# Altium project MML_Control_board.PrjPcb
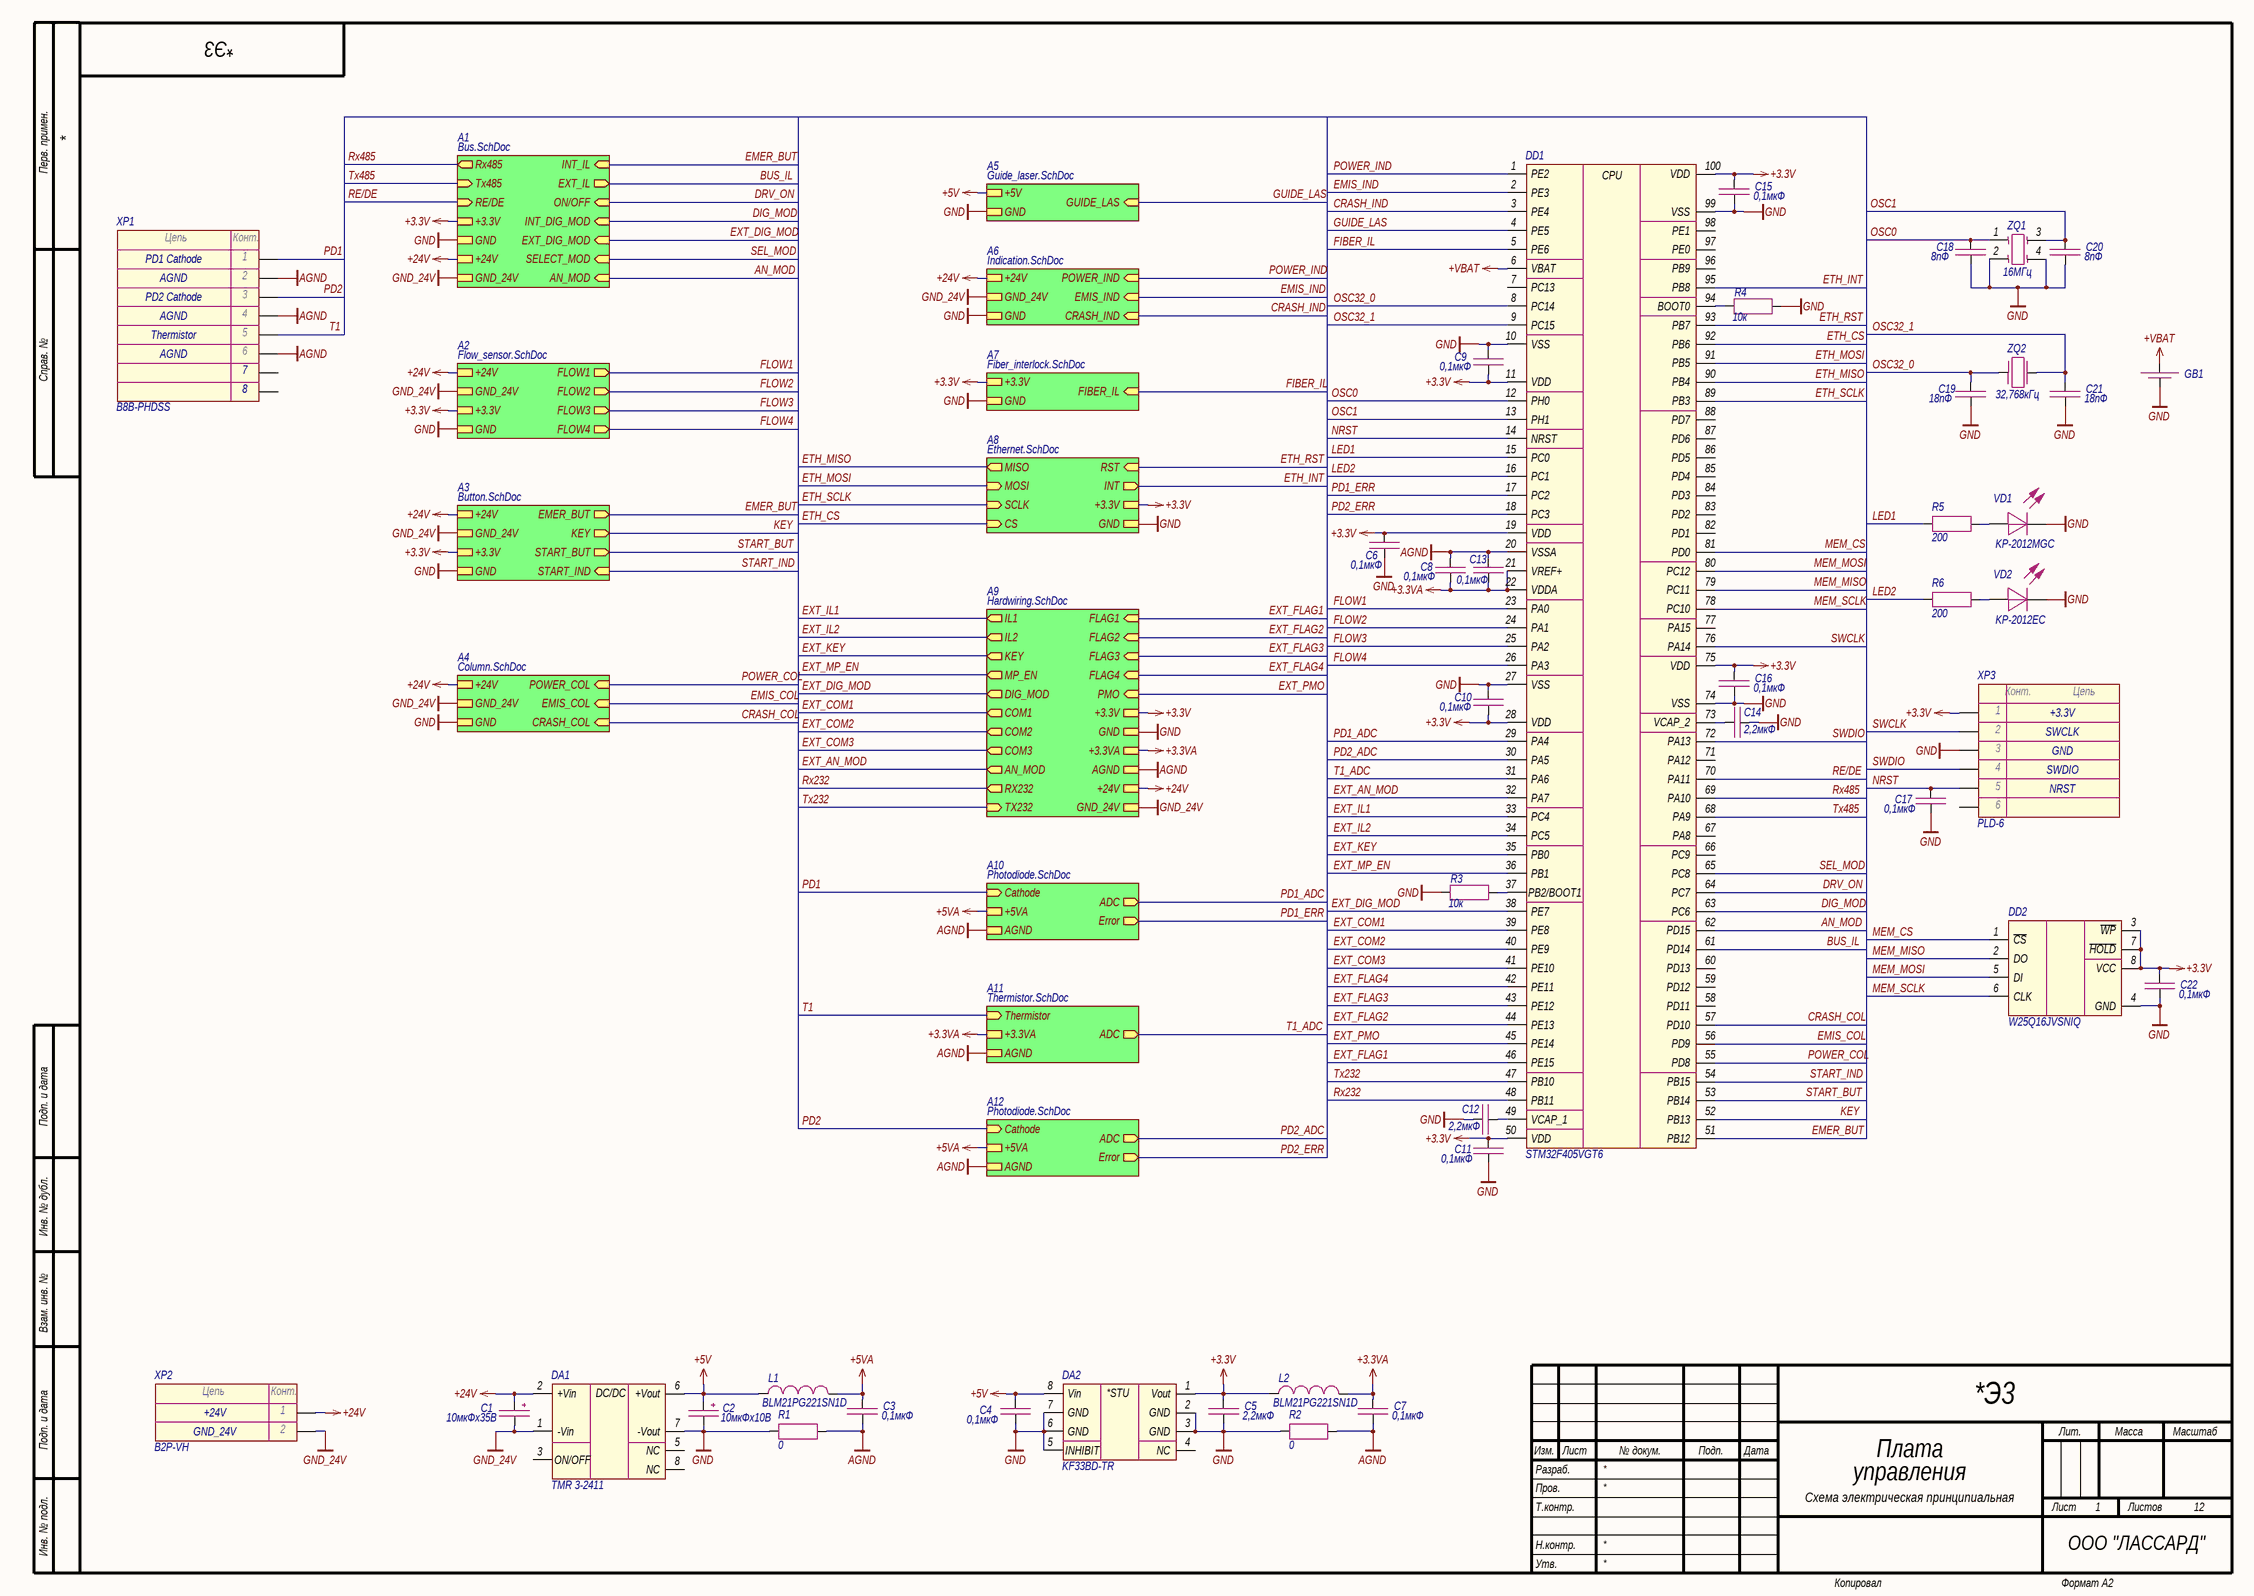
[diagram p0: Main.SchDoc]
12 sheets, 286 parts. Net scope: strictly hierarchical (ports join the sheet entries above them; power ports are local).
Board file: PCB1.PcbDoc
Sheets:
  Main.SchDoc
    A6 = Indication.SchDoc
    A9 = Hardwiring.SchDoc
    A8 = Ethernet.SchDoc
    A5 = Guide_laser.SchDoc
    A7 = Fiber_interlock.SchDoc
    A1 = Bus.SchDoc
    A2 = Flow_sensor.SchDoc
    A3 = Button.SchDoc
    A4 = Column.SchDoc
    A11 = Thermistor.SchDoc
    A10 = Photodiode.SchDoc
    A12 = Photodiode.SchDoc

## Sheet Main.SchDoc: Плата
size 594 x 420 mm; CompanyName: ООО "ЛАССАРД"; Address1: Address1; Address2: Address2; Address3: Address3; Address4: Address4; DocumentNumber: *Э3; SheetNumber: 1; SheetTotal: 12; Title2str: управления; DocumentType: Схема электрическая принципиальная

### Parts
C1  10мкФх35B  [CAP_C]
C2  10мкФх10B  [CAP_A]
C3  0,1мкФ  [CAP_0603]
C4  0,1мкФ  [CAP_0603]
C5  2,2мкФ  [CAP_0603]
C6  0,1мкФ  [CAP_0603]
C7  0,1мкФ  [CAP_0603]
C8  0,1мкФ  [CAP_0603]
C9  0,1мкФ  [CAP_0603]
C10  0,1мкФ  [CAP_0603]
C11  0,1мкФ  [CAP_0603]
C12  2,2мкФ  [CAP_0603]
C13  0,1мкФ  [CAP_0603]
C14  2,2мкФ  [CAP_0603]
C15  0,1мкФ  [CAP_0603]
C16  0,1мкФ  [CAP_0603]
C17  0,1мкФ  [CAP_0603]
C18  8пФ  [CAP_0603]
C19  18пФ  [CAP_0603]
C20  8пФ  [CAP_0603]
C21  18пФ  [CAP_0603]
C22  0,1мкФ  [CAP_0603]
DA1  TMR 3-2411  [TMR3 (SIP-8)]
DA2  KF33BD-TR  [SOIC-8]
DD1  STM32F405VGT6  [LQFP-100]
DD2  W25Q16JVSNIQ  [SOIC-8]
GB1  DS1092-12-N8S  [DS1092-12-N8S]  (value not drawn)
L1  BLM21PG221SN1D  [IND_0805]
L2  BLM21PG221SN1D  [IND_0805]
R1  0  [RES_0805]
R2  0  [RES_0805]
R3  10к  [RES_0603]
R4  10к  [RES_0603]
R5  200  [RES_0603]
R6  200  [RES_0603]
VD1  KP-2012MGC  [LED_0805]
VD2  KP-2012EC  [LED_0805]
XP1  B8B-PHDSS  [B8B-PHDSS]
XP2  B2P-VH  [B2P-VH]
XP3  PLD-6  [PLD-6]
ZQ1  16МГц  [NX2520SA]
ZQ2  32,768кГц  [NX3215SA]

### Sub-sheets
A1 = Bus.SchDoc: EXT_IL (out), +3.3V, GND, ON/OFF (in), AN_MOD (in), Rx485 (out), Tx485 (in), RE/DE (in), +24V, GND_24V, INT_IL (in), INT_DIG_MOD (in), EXT_DIG_MOD (in), SELECT_MOD (in)
A2 = Flow_sensor.SchDoc: FLOW1 (out), +24V, GND_24V, +3.3V, GND, FLOW2 (out), FLOW3 (out), FLOW4 (out)
A3 = Button.SchDoc: EMER_BUT (out), +24V, GND_24V, +3.3V, GND, KEY (out), START_BUT (out), START_IND (in)
A4 = Column.SchDoc: GND_24V, +24V, CRASH_COL (in), POWER_COL (in), EMIS_COL (in), GND
A5 = Guide_laser.SchDoc: GUIDE_LAS (in), +5V, GND
A6 = Indication.SchDoc: GND_24V, +24V, CRASH_IND (in), POWER_IND (in), EMIS_IND (in), GND
A7 = Fiber_interlock.SchDoc: FIBER_IL (in), +3.3V, GND
A8 = Ethernet.SchDoc: MISO (out), RST (in), MOSI (in), INT (out), SCLK (in), CS (in), +3.3V, GND
A9 = Hardwiring.SchDoc: IL1 (out), FLAG1 (in), RX232 (out), TX232 (in), IL2 (out), KEY (out), MP_EN (out), AN_MOD (out), FLAG2 (in), FLAG3 (in), FLAG4 (in), PMO (in), +3.3VA, AGND, +3.3V, GND, GND_24V, +24V, COM1 (out), COM2 (out), COM3 (out), DIG_MOD (out)
A10 = Photodiode.SchDoc: Cathode (in), ADC (out), Error (out), AGND, +5VA
A11 = Thermistor.SchDoc: Thermistor (in), +3.3VA, AGND, ADC (out)
A12 = Photodiode.SchDoc: Cathode (in), ADC (out), Error (out), AGND, +5VA

### Nets
+3.3V: C5.1 C6.1 C9.2 C10.2 C11.2 C15.1 C16.1 C22.1 DA2.1(Vout) DD1.11(VDD) DD1.19(VDD) DD1.28(VDD) DD1.50(VDD) DD1.75(VDD) DD1.100(VDD) DD2.3(~{WP}) DD2.7(~{HOLD}) DD2.8(VCC) L2.1 XP3.1 ; sheet A9/+3.3V, sheet A8/+3.3V, sheet A7/+3.3V, sheet A1/+3.3V, sheet A2/+3.3V, sheet A3/+3.3V
+3.3VA: C7.1 C8.2 C13.2 DD1.21(VREF+) DD1.22(VDDA) L2.2 ; sheet A9/+3.3VA, sheet A11/+3.3VA
+5V: C2.1 C4.1 DA1.6(+Vout) DA2.8(Vin) L1.1 ; sheet A5/+5V
+5VA: C3.1 L1.2 ; sheet A10/+5VA, sheet A12/+5VA
+24V: C1.1 DA1.2(+Vin) XP2.1 ; sheet A6/+24V, sheet A9/+24V, sheet A1/+24V, sheet A2/+24V, sheet A3/+24V, sheet A4/+24V
+VBAT: DD1.6(VBAT) GB1.2
AGND: C3.2 C7.2 C8.1 C13.1 DD1.20(VSSA) R1.2 R2.2 XP1.2 XP1.4 XP1.6 ; sheet A9/AGND, sheet A11/AGND, sheet A10/AGND, sheet A12/AGND
GND: C2.2 C4.2 C5.2 C6.2 C9.1 C10.1 C11.1 C12.2 C14.2 C15.2 C16.2 C17.2 C18.2 C19.2 C20.2 C21.2 C22.2 DA1.7(-Vout) DA2.2(GND) DA2.3(GND) DA2.5(INHIBIT) DA2.6(GND) DA2.7(GND) DD1.10(VSS) DD1.27(VSS) DD1.74(VSS) DD1.99(VSS) DD2.4(GND) GB1.1 R1.1 R2.1 R3.2 R4.2 VD1.2(C) VD2.2(C) XP3.3 ZQ1.2 ZQ1.4 ; sheet A6/GND, sheet A9/GND, sheet A8/GND, sheet A5/GND, sheet A7/GND, sheet A1/GND, sheet A2/GND, sheet A3/GND, sheet A4/GND
GND_24V: C1.2 DA1.1(-Vin) XP2.2 ; sheet A6/GND_24V, sheet A9/GND_24V, sheet A1/GND_24V, sheet A2/GND_24V, sheet A3/GND_24V, sheet A4/GND_24V
AN_MOD: DD1.62(PD15) ; sheet A1/AN_MOD
BUS_IL: DD1.61(PD14) ; sheet A1/EXT_IL
CRASH_COL: DD1.57(PD10) ; sheet A4/CRASH_COL
CRASH_IND: DD1.3(PE4) ; sheet A6/CRASH_IND
DIG_MOD: DD1.63(PC6) ; sheet A1/INT_DIG_MOD
DRV_ON: DD1.64(PC7) ; sheet A1/ON/OFF
EMER_BUT: DD1.51(PB12) ; sheet A1/INT_IL, sheet A3/EMER_BUT
EMIS_COL: DD1.56(PD9) ; sheet A4/EMIS_COL
EMIS_IND: DD1.2(PE3) ; sheet A6/EMIS_IND
ETH_CS: DD1.92(PB6) ; sheet A8/CS
ETH_INT: DD1.95(PB8) ; sheet A8/INT
ETH_MISO: DD1.90(PB4) ; sheet A8/MISO
ETH_MOSI: DD1.91(PB5) ; sheet A8/MOSI
ETH_RST: DD1.93(PB7) ; sheet A8/RST
ETH_SCLK: DD1.89(PB3) ; sheet A8/SCLK
EXT_AN_MOD: DD1.32(PA7) ; sheet A9/AN_MOD
EXT_COM1: DD1.39(PE8) ; sheet A9/COM1
EXT_COM2: DD1.40(PE9) ; sheet A9/COM2
EXT_COM3: DD1.41(PE10) ; sheet A9/COM3
EXT_DIG_MOD: DD1.38(PE7) ; sheet A9/DIG_MOD, sheet A1/EXT_DIG_MOD
EXT_FLAG1: DD1.46(PE15) ; sheet A9/FLAG1
EXT_FLAG2: DD1.44(PE13) ; sheet A9/FLAG2
EXT_FLAG3: DD1.43(PE12) ; sheet A9/FLAG3
EXT_FLAG4: DD1.42(PE11) ; sheet A9/FLAG4
EXT_IL1: DD1.33(PC4) ; sheet A9/IL1
EXT_IL2: DD1.34(PC5) ; sheet A9/IL2
EXT_KEY: DD1.35(PB0) ; sheet A9/KEY
EXT_MP_EN: DD1.36(PB1) ; sheet A9/MP_EN
EXT_PMO: DD1.45(PE14) ; sheet A9/PMO
FIBER_IL: DD1.5(PE6) ; sheet A7/FIBER_IL
FLOW1: DD1.23(PA0) ; sheet A2/FLOW1
FLOW2: DD1.24(PA1) ; sheet A2/FLOW2
FLOW3: DD1.25(PA2) ; sheet A2/FLOW3
FLOW4: DD1.26(PA3) ; sheet A2/FLOW4
GUIDE_LAS: DD1.4(PE5) ; sheet A5/GUIDE_LAS
KEY: DD1.52(PB13) ; sheet A3/KEY
LED1: DD1.15(PC0) R5.1
LED2: DD1.16(PC1) R6.1
MEM_CS: DD1.81(PD0) DD2.1(~{CS})
MEM_MISO: DD1.79(PC11) DD2.2(DO)
MEM_MOSI: DD1.80(PC12) DD2.5(DI)
MEM_SCLK: DD1.78(PC10) DD2.6(CLK)
NRST: C17.1 DD1.14(NRST) XP3.5
OSC0: C18.1 DD1.12(PH0) ZQ1.1
OSC1: C20.1 DD1.13(PH1) ZQ1.3
OSC32_0: C19.1 DD1.8(PC14) ZQ2.1
OSC32_1: C21.1 DD1.9(PC15) ZQ2.2
PD1: XP1.1 ; sheet A10/Cathode
PD1_ADC: DD1.29(PA4) ; sheet A10/ADC
PD1_ERR: DD1.17(PC2) ; sheet A10/Error
PD2: XP1.3 ; sheet A12/Cathode
PD2_ADC: DD1.30(PA5) ; sheet A12/ADC
PD2_ERR: DD1.18(PC3) ; sheet A12/Error
POWER_COL: DD1.55(PD8) ; sheet A4/POWER_COL
POWER_IND: DD1.1(PE2) ; sheet A6/POWER_IND
RE/DE: DD1.70(PA11) ; sheet A1/RE/DE
Rx232: DD1.48(PB11) ; sheet A9/RX232
Rx485: DD1.69(PA10) ; sheet A1/Rx485
SEL_MOD: DD1.65(PC8) ; sheet A1/SELECT_MOD
START_BUT: DD1.53(PB14) ; sheet A3/START_BUT
START_IND: DD1.54(PB15) ; sheet A3/START_IND
SWCLK: DD1.76(PA14) XP3.2
SWDIO: DD1.72(PA13) XP3.4
T1: XP1.5 ; sheet A11/Thermistor
T1_ADC: DD1.31(PA6) ; sheet A11/ADC
Tx232: DD1.47(PB10) ; sheet A9/TX232
Tx485: DD1.68(PA9) ; sheet A1/Tx485
NetC12_1: C12.1 DD1.49(VCAP_1)
NetC14_1: C14.1 DD1.73(VCAP_2)
NetDD1_37: DD1.37(PB2/BOOT1) R3.1
NetDD1_94: DD1.94(BOOT0) R4.1
NetR5_2: R5.2 VD1.1(A)
NetR6_2: R6.2 VD2.1(A)

Not connected (* = marked no-connect by the designer): DA1 3(ON/OFF) 5(NC) 8(NC); DA2 4(NC); DD1 7(PC13) 58(PD11) 59(PD12) 60(PD13) 66(PC9) 67(PA8) 71(PA12) 77(PA15) 82(PD1) 83(PD2) 84(PD3) 85(PD4) 86(PD5) 87(PD6) 88(PD7) 96(PB9) 97(PE0) 98(PE1); XP1 7 8; XP3 6

### Notes on the sheet
- PD1 Cathode
- AGND
- PD2 Cathode
- Thermistor
- +3.3V
- SWCLK
- GND
- NRST
- SWDIO
- +24V
- GND_24V
- Перв. примен.
- Справ. №
- Подп. и дата
- Инв. № дубл.
- Взам. инв. №
- Разраб.
- Изм.
- Лист
- № докум.
- Подп.
- Дата
- Лит.
- Масса
- Масштаб
- Пров.
- Т.контр.
- Листов
- Инв. № подл.
- Утв.
- Н.контр.
- Копировал
- Формат А2
- (in symbol Connector-2) Цепь; Конт.
- (in symbol Connector-8) Цепь; Конт.
- (in symbol KFXXBD-TR) *STU
- (in symbol STM32F405VG) CPU
- (in symbol TMR3) DC/DC

### Library data of the parts
C1 = Capacitor_Polar: Model: TECAP, 10 мкФ, 35 В, тип C, 10%; Value: 10мкФх35B; Document: *; Manufacturer: *
C2 = Capacitor_Polar: Model: TECAP, 10 мкФ, 10 В, тип A, 10%; Value: 10мкФх10B; Document: *; Manufacturer: *
C3 C4 C6-C11 C13 C15-C17 C22 = Capacitor: Manufacturer: Murata; Model: GRM188R71H104KA93D; Value: 0,1мкФ; Document: *
C5 C12 C14 = Capacitor: Manufacturer: Murata; Model: GRM188R61H225KE11D; Value: 2,2мкФ; Document: *
C18 C20 = Capacitor: Manufacturer: Yageo; Model: CC0603CRNPO9BN8R0; Value: 8пФ; Document: *
C19 C21 = Capacitor: Manufacturer: Murata; Model: GRM1885C1H180FA01D; Value: 18пФ; Document: *
DA1 = TMR3: Manufacturer: Traco Power; Model: TMR 3-2411; Document: *
DA2 = KFXXBD-TR: Manufacturer: STMicroelectronics; Model: KF33BD-TR; Document: *
DD1 = STM32F405VG: Manufacturer: STMicroelectronics; Model: STM32F405VGT6; Document: *
DD2 = W25Q: Manufacturer: Winbond; Model: W25Q16JVSNIQ; Document: *
GB1 = Accumulator: Manufacturer: Connfly; Model: DS1092-12-N8S; Document: *
L1 L2 = Inductor: Manufacturer: Murata; Value: *; Model: BLM21PG221SN1D; Document: *
R1 R2 = Resistor: Manufacturer: Yageo; Model: RC0805FR-070RL; Value: 0; Document: *
R3 R4 = Resistor: Manufacturer: Yageo; Model: RC0603FR-0710KL; Value: 10к; Document: *
R5 R6 = Resistor: Manufacturer: Yageo; Model: RC0603FR-07200RL; Value: 200; Document: *
VD1 VD2 = LED: Manufacturer: Kingbright; Document: *
  VD1: Model: KP-2012MGC
  VD2: Model: KP-2012EC
XP1 = Connector-8: Manufacturer: JST; Model: B8B-PHDSS; Document: *
XP2 = Connector-2: Manufacturer: JST; Model: B2P-VH; Document: *
XP3 = Connector-6: Manufacturer: Connfly; Model: PLD-6; Document: *
ZQ1 = Quartz_Resonator_4-pin: Manufacturer: NDK; Model: NX2520SA-16MHZ-STD-CSW-5; Value: 16МГц; Document: *
ZQ2 = Quartz_Resonator: Manufacturer: NDK; Model: NX3215SA- 32.768K-STD-MUA-8; Value: 32,768кГц; Document: *

## Sheet Indication.SchDoc
size 420 x 297 mm; Address1: Address1; Address2: Address2; Address3: Address3; Address4: Address4; DocumentNumber: *Э3; SheetNumber: 6; SheetTotal: 12; DocumentType: Схема электрическая *
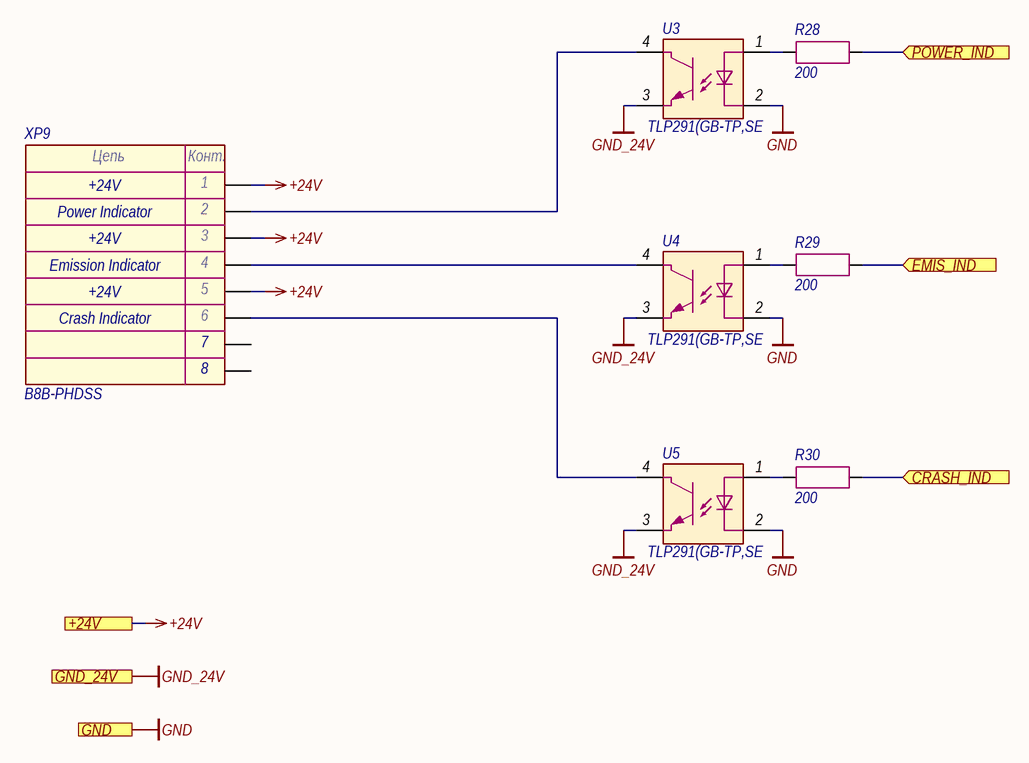
[diagram p1: Indication.SchDoc]

### Parts
R28  200  [RES_0603]
R29  200  [RES_0603]
R30  200  [RES_0603]
U3  TLP291(GB-TP,SE  [11-3C1]
U4  TLP291(GB-TP,SE  [11-3C1]
U5  TLP291(GB-TP,SE  [11-3C1]
XP9  B8B-PHDSS  [B8B-PHDSS]

### Ports
+24V (see Main[2A], Bus[1D], Button[1C], Column[1C], Flow_sensor[2C], Hardwiring[3C]), CRASH_IND (in, see Main[3A]), EMIS_IND (in, see Main[3A]), GND (see Main[2A], Bus[1D], Button[1D], Column[1C], Ethernet[3D], Fiber_interlock[2C], Flow_sensor[2C], Guide_laser[1C], Hardwiring[3D]), GND_24V (see Main[2A], Bus[1D], Button[1D], Column[1C], Flow_sensor[2C], Hardwiring[3C]), POWER_IND (in, see Main[3A])

### Nets
+24V: XP9.1 XP9.3 XP9.5 ; port +24V
GND: U3.2 U4.2 U5.2 ; port GND
GND_24V: U3.3 U4.3 U5.3 ; port GND_24V
CRASH_IND: R30.2 ; port CRASH_IND
EMIS_IND: R29.2 ; port EMIS_IND
POWER_IND: R28.2 ; port POWER_IND
NetR28_1: R28.1 U3.1
NetR29_1: R29.1 U4.1
NetR30_1: R30.1 U5.1
NetU3_4: U3.4 XP9.2
NetU4_4: U4.4 XP9.4
NetU5_4: U5.4 XP9.6

Not connected (* = marked no-connect by the designer): XP9 7 8

### Notes on the sheet
- Power Indicator
- +24V
- (near XP9) Emission Indicator
- Crash Indicator
- Подп. и дата
- Инв. № дубл.
- Взам. инв. №
- Инв. № подл.
- Изм.
- Лист
- № докум.
- Подп.
- Дата
- Копировал
- Формат А3
- (in symbol Connector-8) Цепь; Конт.

### Library data of the parts
R28-R30 = Resistor: as R5 on sheet Main; Value: 200; Document: *
U3-U5 = TLP291: Manufacturer: Toshiba; Model: TLP291(GB-TP,SE; Document: *
XP9 = Connector-8: Manufacturer: JST; Model: B8B-PHDSS; Document: *

## Sheet Hardwiring.SchDoc
size 594 x 420 mm; Address1: Address1; Address2: Address2; Address3: Address3; Address4: Address4; DocumentNumber: *Э3; SheetNumber: 10; SheetTotal: 12; DocumentType: Схема электрическая *
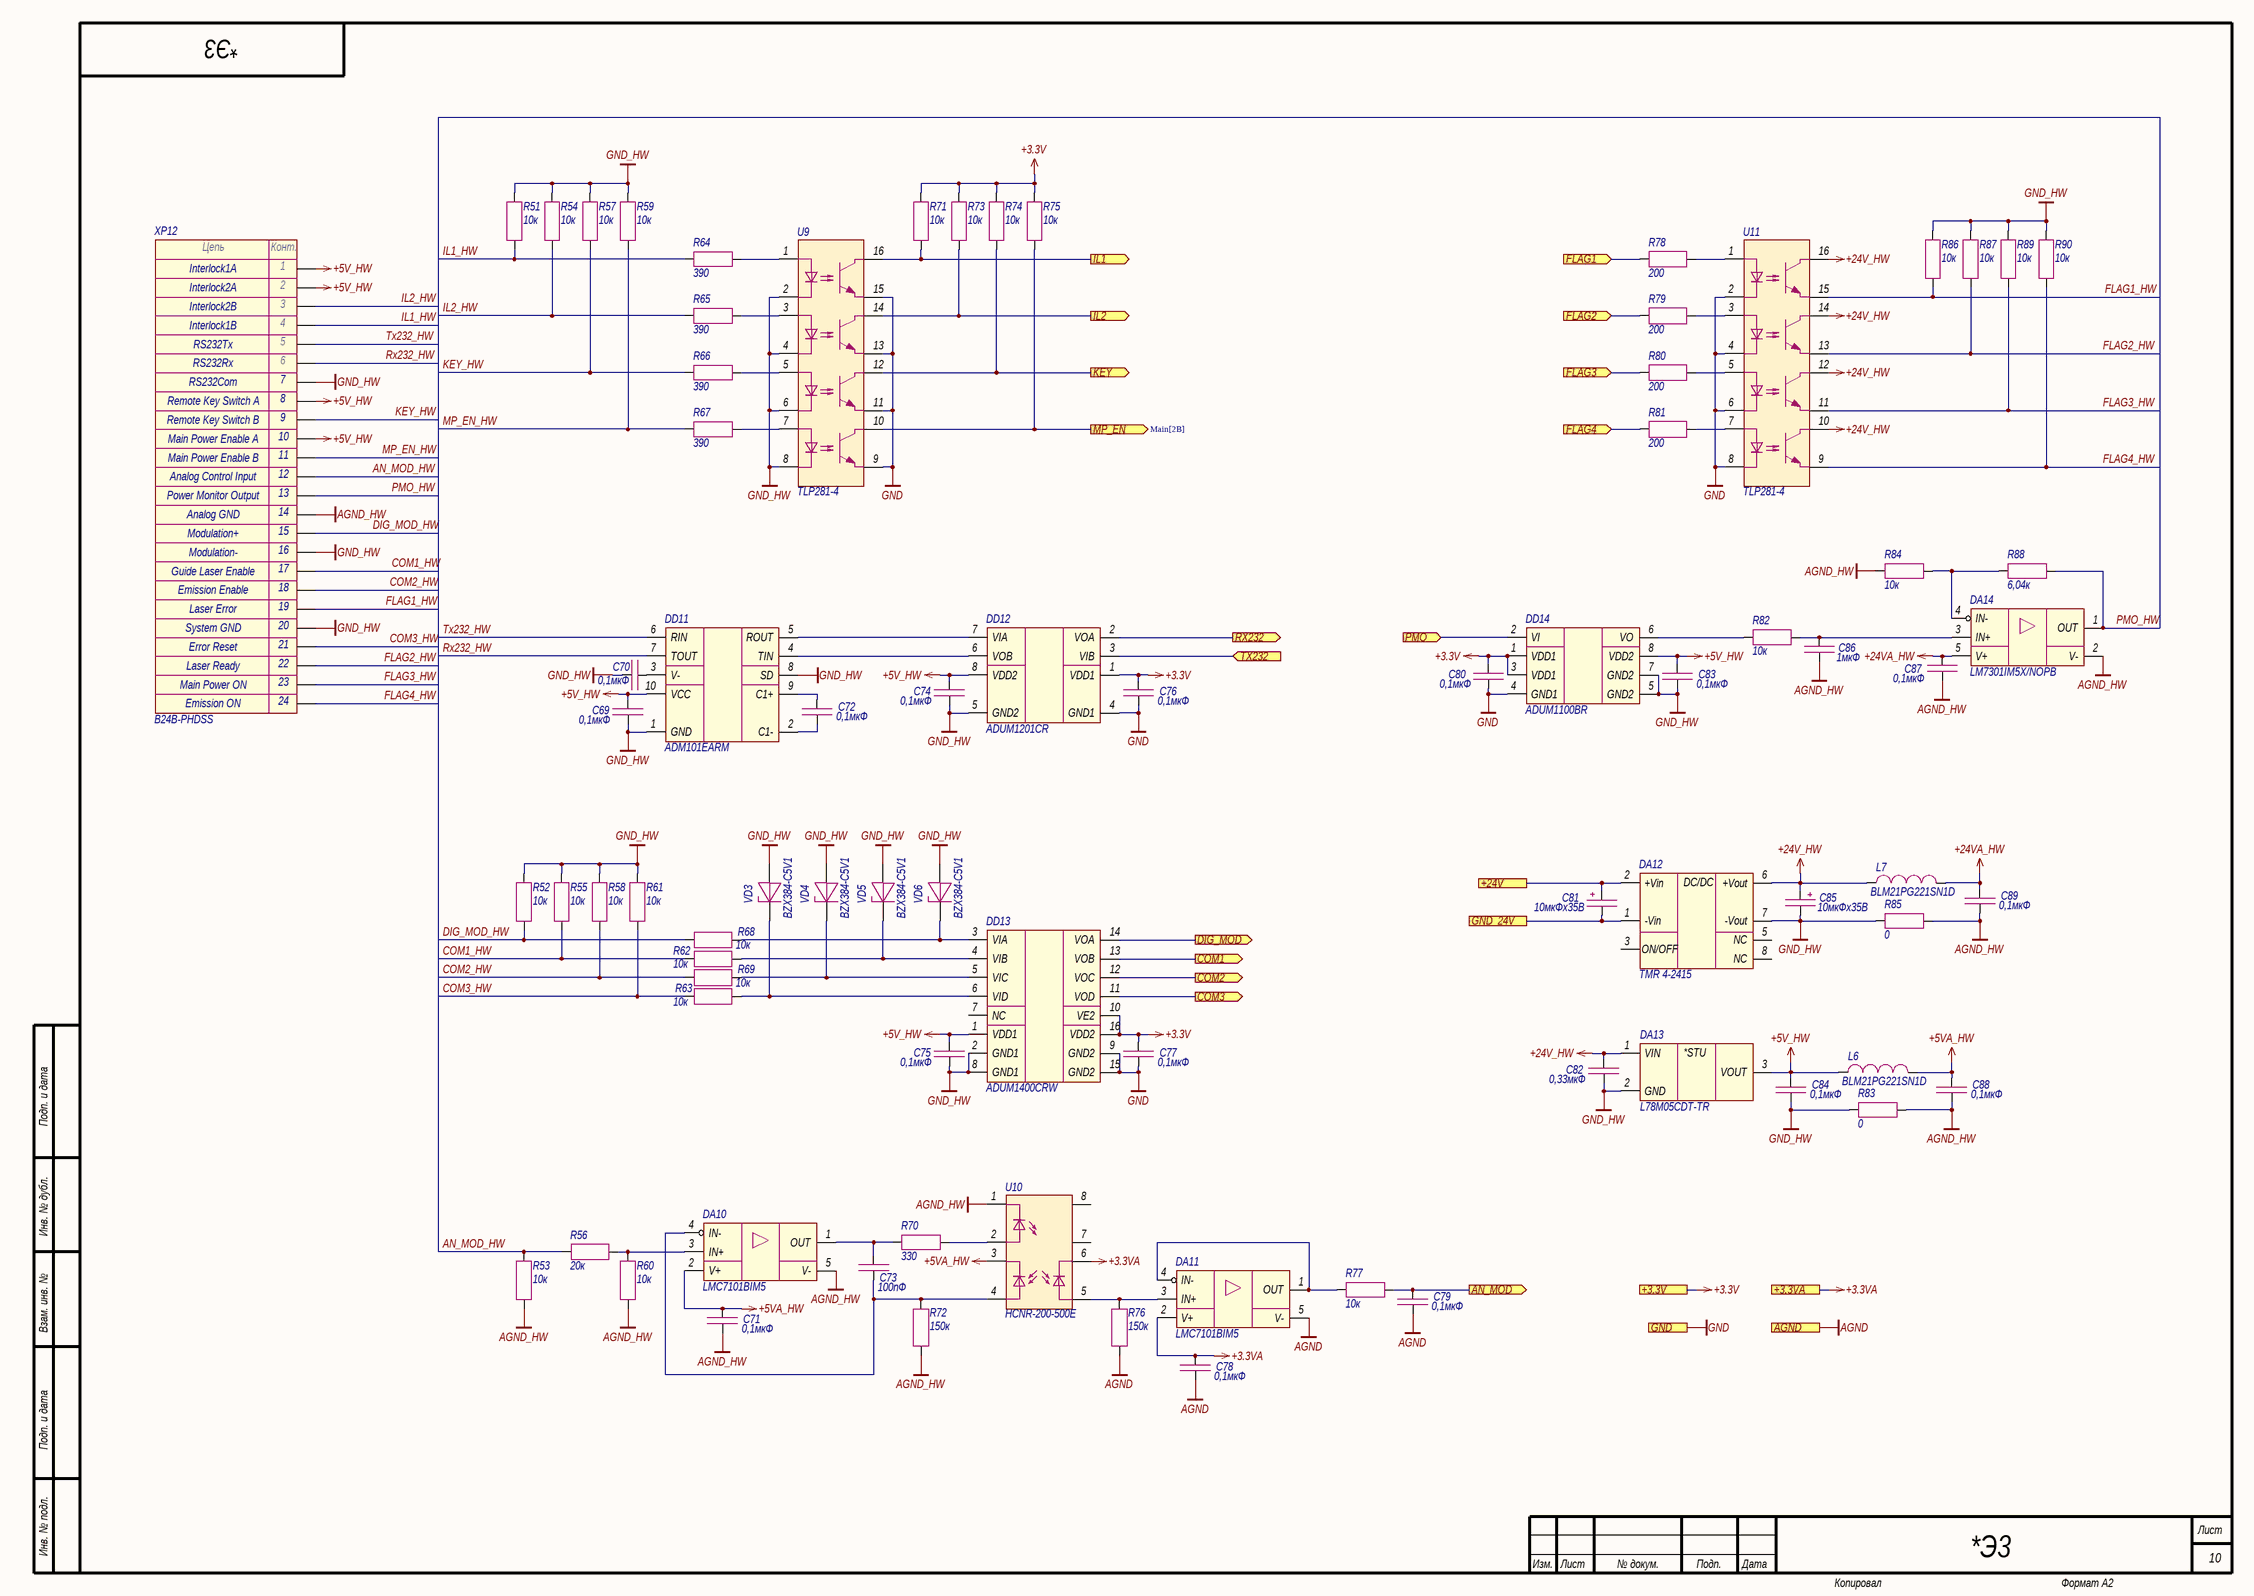
[diagram p2: Hardwiring.SchDoc]

### Parts
C69  0,1мкФ  [CAP_0603]
C70  0,1мкФ  [CAP_0603]
C71  0,1мкФ  [CAP_0603]
C72  0,1мкФ  [CAP_0603]
C73  100пФ  [CAP_0603]
C74  0,1мкФ  [CAP_0603]
C75  0,1мкФ  [CAP_0603]
C76  0,1мкФ  [CAP_0603]
C77  0,1мкФ  [CAP_0603]
C78  0,1мкФ  [CAP_0603]
C79  0,1мкФ  [CAP_0603]
C80  0,1мкФ  [CAP_0603]
C81  10мкФх35B  [CAP_C]
C82  0,33мкФ  [CAP_0805]
C83  0,1мкФ  [CAP_0603]
C84  0,1мкФ  [CAP_0603]
C85  10мкФх35B  [CAP_C]
C86  1мкФ  [CAP_0603]
C87  0,1мкФ  [CAP_0603]
C88  0,1мкФ  [CAP_0603]
C89  0,1мкФ  [CAP_0603]
DA10  LMC7101BIM5  [SOT-23-5]
DA11  LMC7101BIM5  [SOT-23-5]
DA12  TMR 4-2415  [TMR4 (SIP-8)]
DA13  L78M05CDT-TR  [TO-252]
DA14  LM7301IM5X/NOPB  [SOT-23-5]
DD11  ADM101EARM  [MSOP-10]
DD12  ADUM1201CR  [SOIC-8]
DD13  ADUM1400CRW  [SOIC-16W]
DD14  ADUM1100BR  [SOIC-8]
L6  BLM21PG221SN1D  [IND_0805]
L7  BLM21PG221SN1D  [IND_0805]
R51  10к  [RES_0603]
R52  10к  [RES_0603]
R53  10к  [RES_0603]
R54  10к  [RES_0603]
R55  10к  [RES_0603]
R56  20к  [RES_0603]
R57  10к  [RES_0603]
R58  10к  [RES_0603]
R59  10к  [RES_0603]
R60  10к  [RES_0603]
R61  10к  [RES_0603]
R62  10к  [RES_0603]
R63  10к  [RES_0603]
R64  390  [RES_0603]
R65  390  [RES_0603]
R66  390  [RES_0603]
R67  390  [RES_0603]
R68  10к  [RES_0603]
R69  10к  [RES_0603]
R70  330  [RES_0603]
R71  10к  [RES_0603]
R72  150к  [RES_0603]
R73  10к  [RES_0603]
R74  10к  [RES_0603]
R75  10к  [RES_0603]
R76  150к  [RES_0603]
R77  10к  [RES_0603]
R78  200  [RES_0603]
R79  200  [RES_0603]
R80  200  [RES_0603]
R81  200  [RES_0603]
R82  10к  [RES_0603]
R83  0  [RES_0805]
R84  10к  [RES_0603]
R85  0  [RES_0805]
R86  10к  [RES_0603]
R87  10к  [RES_0603]
R88  6,04к  [RES_0603]
R89  10к  [RES_0603]
R90  10к  [RES_0603]
U9  TLP281-4  [SOP-16]
U10  HCNR-200-500E  [HCNR200]
U11  TLP281-4  [SOP-16]
VD3  BZX384-C5V1  [SOD-323]
VD4  BZX384-C5V1  [SOD-323]
VD5  BZX384-C5V1  [SOD-323]
VD6  BZX384-C5V1  [SOD-323]
XP12  B24B-PHDSS  [B24B-PHDSS]

### Ports
+3.3V (see Main[3B], Bus[1D], Button[1D], Ethernet[3D], Fiber_interlock[2C], Flow_sensor[2C]), +3.3VA (see Main[3B], Thermistor[2C]), +24V (see Main[3B], Bus[1D], Button[1C], Column[1C], Flow_sensor[2C], Indication[1C]), AGND (see Main[3B], Photodiode[1C], Thermistor[2C]), AN_MOD (out, see Main[2B]), COM1 (out, see Main[2B]), COM2 (out, see Main[2B]), COM3 (out, see Main[2B]), DIG_MOD (out, see Main[2B]), FLAG1 (in, see Main[3B]), FLAG2 (in, see Main[3B]), FLAG3 (in, see Main[3B]), FLAG4 (in, see Main[3B]), GND (see Main[3B], Bus[1D], Button[1D], Column[1C], Ethernet[3D], Fiber_interlock[2C], Flow_sensor[2C], Guide_laser[1C], Indication[1C]), GND_24V (see Main[3C], Bus[1D], Button[1D], Column[1C], Flow_sensor[2C], Indication[1C]), IL1 (out, see Main[2B]), IL2 (out, see Main[2B]), KEY (out, see Main[2B]), MP_EN (out, see Main[2B]), PMO (in, see Main[3B]), RX232 (out, see Main[2B]), TX232 (in, see Main[2C])

### Nets
+3.3V: C76.1 C77.1 C80.1 DD12.1(VDD1) DD13.10(VE2) DD13.16(VDD2) DD14.1(VDD1) DD14.3(VDD1) R71.1 R73.1 R74.1 R75.1 ; port +3.3V
+3.3VA: C78.1 DA11.2(V+) U10.6 ; port +3.3VA
+5V_HW: C69.1 C74.1 C75.1 C83.1 C84.1 DA13.3(VOUT) DD11.10(VCC) DD12.8(VDD2) DD13.1(VDD1) DD14.8(VDD2) L6.1 XP12.1 XP12.2 XP12.8 XP12.10
+5VA_HW: C71.1 C88.1 DA10.2(V+) L6.2 U10.3
+24V: C81.1 DA12.2(+Vin) ; port +24V
+24V_HW: C82.2 C85.1 DA12.6(+Vout) DA13.1(VIN) L7.1 U11.10 U11.12 U11.14 U11.16
+24VA_HW: C87.1 C89.1 DA14.5(V+) L7.2
AGND: C78.2 C79.2 DA11.5(V-) R76.2 ; port AGND
AGND_HW: C71.2 C86.2 C87.2 C88.2 C89.2 DA10.5(V-) DA14.2(V-) R53.2 R60.2 R72.2 R83.2 R84.1 R85.2 U10.1 XP12.14
GND: C76.2 C77.2 C80.2 DD12.4(GND1) DD13.9(GND2) DD13.15(GND2) DD14.4(GND1) U9.9 U9.11 U9.13 U9.15 U11.2 U11.4 U11.6 U11.8 ; port GND
GND_24V: C81.2 DA12.1(-Vin) ; port GND_24V
GND_HW: C69.2 C70.2 C74.2 C75.2 C82.1 C83.2 C84.2 C85.2 DA12.7(-Vout) DA13.2(GND) DD11.1(GND) DD11.8(SD) DD12.5(GND2) DD13.2(GND1) DD13.8(GND1) DD14.5(GND2) DD14.7(GND2) R51.1 R52.1 R54.1 R55.1 R57.1 R58.1 R59.1 R61.1 R83.1 R85.1 R86.1 R87.1 R89.1 R90.1 U9.2 U9.4 U9.6 U9.8 VD3.2(A) VD4.2(A) VD5.2(A) VD6.2(A) XP12.7 XP12.16 XP12.20
AN_MOD_HW: R53.1 R56.1 XP12.12
COM1_HW: R55.2 R62.1 XP12.17
COM2_HW: R58.2 R69.1 XP12.18
COM3_HW: R61.2 R63.1 XP12.21
DIG_MOD_HW: R52.2 R68.1 XP12.15
EXT_AN_MOD: C79.1 R77.2 ; port AN_MOD
EXT_COM1: DD13.13(VOB) ; port COM1
EXT_COM2: DD13.12(VOC) ; port COM2
EXT_COM3: DD13.11(VOD) ; port COM3
EXT_DIG_MOD: DD13.14(VOA) ; port DIG_MOD
EXT_FLAG1: R78.2 ; port FLAG1
EXT_FLAG2: R79.2 ; port FLAG2
EXT_FLAG3: R80.2 ; port FLAG3
EXT_FLAG4: R81.2 ; port FLAG4
EXT_IL1: R71.2 U9.16 ; port IL1
EXT_IL2: R73.2 U9.14 ; port IL2
EXT_KEY: R74.2 U9.12 ; port KEY
EXT_MP_EN: R75.2 U9.10 ; port MP_EN
EXT_PMO: DD14.2(VI) ; port PMO
FLAG1_HW: R86.2 U11.15 XP12.19
FLAG2_HW: R87.2 U11.13 XP12.22
FLAG3_HW: R89.2 U11.11 XP12.23
FLAG4_HW: R90.2 U11.9 XP12.24
IL1_HW: R51.2 R64.1 XP12.4
IL2_HW: R54.2 R65.1 XP12.3
KEY_HW: R57.2 R66.1 XP12.9
MP_EN_HW: R59.2 R67.1 XP12.11
PMO_HW: DA14.1(OUT) R88.2 XP12.13
Rx232: DD12.2(VOA) ; port RX232
Rx232_HW: DD11.7(TOUT) XP12.6
Tx232: DD12.3(VIB) ; port TX232
Tx232_HW: DD11.6(RIN) XP12.5
NetC70_1: C70.1 DD11.3(V-)
NetC72_1: C72.1 DD11.9(C1+)
NetC72_2: C72.2 DD11.2(C1-)
NetC73_1: C73.1 DA10.1(OUT) R70.1
NetC73_2: C73.2 DA10.4(IN-) R72.1 U10.4
NetC86_1: C86.1 DA14.3(IN+) R82.2
NetDA10_3: DA10.3(IN+) R56.2 R60.1
NetDA11_1: DA11.1(OUT) DA11.4(IN-) R77.1
NetDA11_3: DA11.3(IN+) R76.1 U10.5
NetDA14_4: DA14.4(IN-) R84.2 R88.1
NetDD11_4: DD11.4(TIN) DD12.6(VOB)
NetDD11_5: DD11.5(ROUT) DD12.7(VIA)
NetDD13_3: DD13.3(VIA) R68.2 VD6.1(K)
NetDD13_4: DD13.4(VIB) R62.2 VD5.1(K)
NetDD13_5: DD13.5(VIC) R69.2 VD4.1(K)
NetDD13_6: DD13.6(VID) R63.2 VD3.1(K)
NetDD14_6: DD14.6(VO) R82.1
NetR64_2: R64.2 U9.1
NetR65_2: R65.2 U9.3
NetR66_2: R66.2 U9.5
NetR67_2: R67.2 U9.7
NetR70_2: R70.2 U10.2
NetR78_1: R78.1 U11.1
NetR79_1: R79.1 U11.3
NetR80_1: R80.1 U11.5
NetR81_1: R81.1 U11.7

Not connected (* = marked no-connect by the designer): DA12 3(ON/OFF) 5(NC) 8(NC); DD13 7(NC); U10 7 8

### Notes on the sheet
- Interlock1A
- Interlock2A
- Interlock2B
- Interlock1B
- RS232Tx
- RS232Rx
- RS232Com
- (near XP12) Remote Key Switch A
- (near XP12) Remote Key Switch B
- (near XP12) Main Power Enable A
- (near XP12) Main Power Enable B
- (near XP12) Analog Control Input
- (near XP12) Power Monitor Output
- Analog GND
- Modulation+
- Modulation-
- (near XP12) Guide Laser Enable
- (near XP12) Emission Enable
- System GND
- Error Reset
- Laser Error
- Main Power ON
- Emission ON
- Laser Ready
- Подп. и дата
- Инв. № дубл.
- Взам. инв. №
- Инв. № подл.
- Изм.
- Лист
- № докум.
- Подп.
- Дата
- Копировал
- Формат А2
- (in symbol Connector-24) Цепь; Конт.
- (in symbol L78M) *STU
- (in symbol TMR4) DC/DC

### Library data of the parts
C69-C72 C74-C80 C83 C84 C87-C89 = Capacitor: as C3 on sheet Main; Value: 0,1мкФ; Document: *
C73 = Capacitor: Manufacturer: Murata; Model: GRM1885C1H101JA01D; Value: 100пФ; Document: *
C81 C85 = Capacitor_Polar: Model: TECAP, 10 мкФ, 35 В, тип C, 10%; Value: 10мкФх35B; Document: *; Manufacturer: *
C82 = Capacitor: Manufacturer: Murata; Model: GRM219R71H334KA88D; Value: 0,33мкФ; Document: *
C86 = Capacitor: Manufacturer: Murata; Model: GRM188R61H105KAALD; Value: 1мкФ; Document: *
DA10 DA11 = LMC7101: Manufacturer: Texas Instruments; Model: LMC7101BIM5; Document: *
DA12 = TMR4: Manufacturer: Traco Power; Model: TMR 4-2415; Document: *
DA13 = L78M: Manufacturer: STMicroelectronics; Model: L78M05CDT-TR; Document: *
DA14 = LM7301IM5: Manufacturer: Texas Instruments; Model: LM7301IM5X/NOPB; Document: *
DD11 = ADM101EARM: Manufacturer: Analog Devices; Model: ADM101EARM; Document: *
DD12 = ADUM1201: Manufacturer: Analog Devices; Model: ADUM1201CR; Document: *
DD13 = ADUM1400: Manufacturer: Analog Devices; Model: ADUM1400CRW; Document: *
DD14 = ADUM1100: Manufacturer: Analog Devices; Model: ADUM1100BR; Document: *
L6 L7 = Inductor: Manufacturer: Murata; Value: *; Model: BLM21PG221SN1D; Document: *
R51-R55 R57-R63 R68 R69 R71 R73-R75 R77 R82 R84 R86 R87 R89 R90 = Resistor: as R3 on sheet Main; Value: 10к; Document: *
R56 = Resistor: Manufacturer: Yageo; Model: RC0603FR-0720KL; Value: 20к; Document: *
R64-R67 = Resistor: Manufacturer: Yageo; Model: RC0603FR-07390RL; Value: 390; Document: *
R70 = Resistor: Manufacturer: Yageo; Model: RC0603FR-07330RL; Value: 330; Document: *
R72 R76 = Resistor: Manufacturer: Yageo; Model: RC0603FR-07150KL; Value: 150к; Document: *
R78-R81 = Resistor: as R5 on sheet Main; Value: 200; Document: *
R83 R85 = Resistor: as R1 on sheet Main; Value: 0; Document: *
R88 = Resistor: Manufacturer: Yageo; Model: RC0603FR-076K04L; Value: 6,04к; Document: *
U9 U11 = TLP281-4: Manufacturer: Toshiba; Model: TLP281-4; Document: *
U10 = HCNR200: Manufacturer: Avago; Model: HCNR-200-500E; Document: *
VD3-VD6 = Diode_Zener: Manufacturer: Nexperia; Model: BZX384-C5V1; Document: *
XP12 = Connector-24: Manufacturer: JST; Model: B24B-PHDSS; Document: *

## Sheet Ethernet.SchDoc
size 420 x 297 mm; Address1: Address1; Address2: Address2; Address3: Address3; Address4: Address4; DocumentNumber: *Э3; SheetNumber: 9; SheetTotal: 12; DocumentType: Схема электрическая *
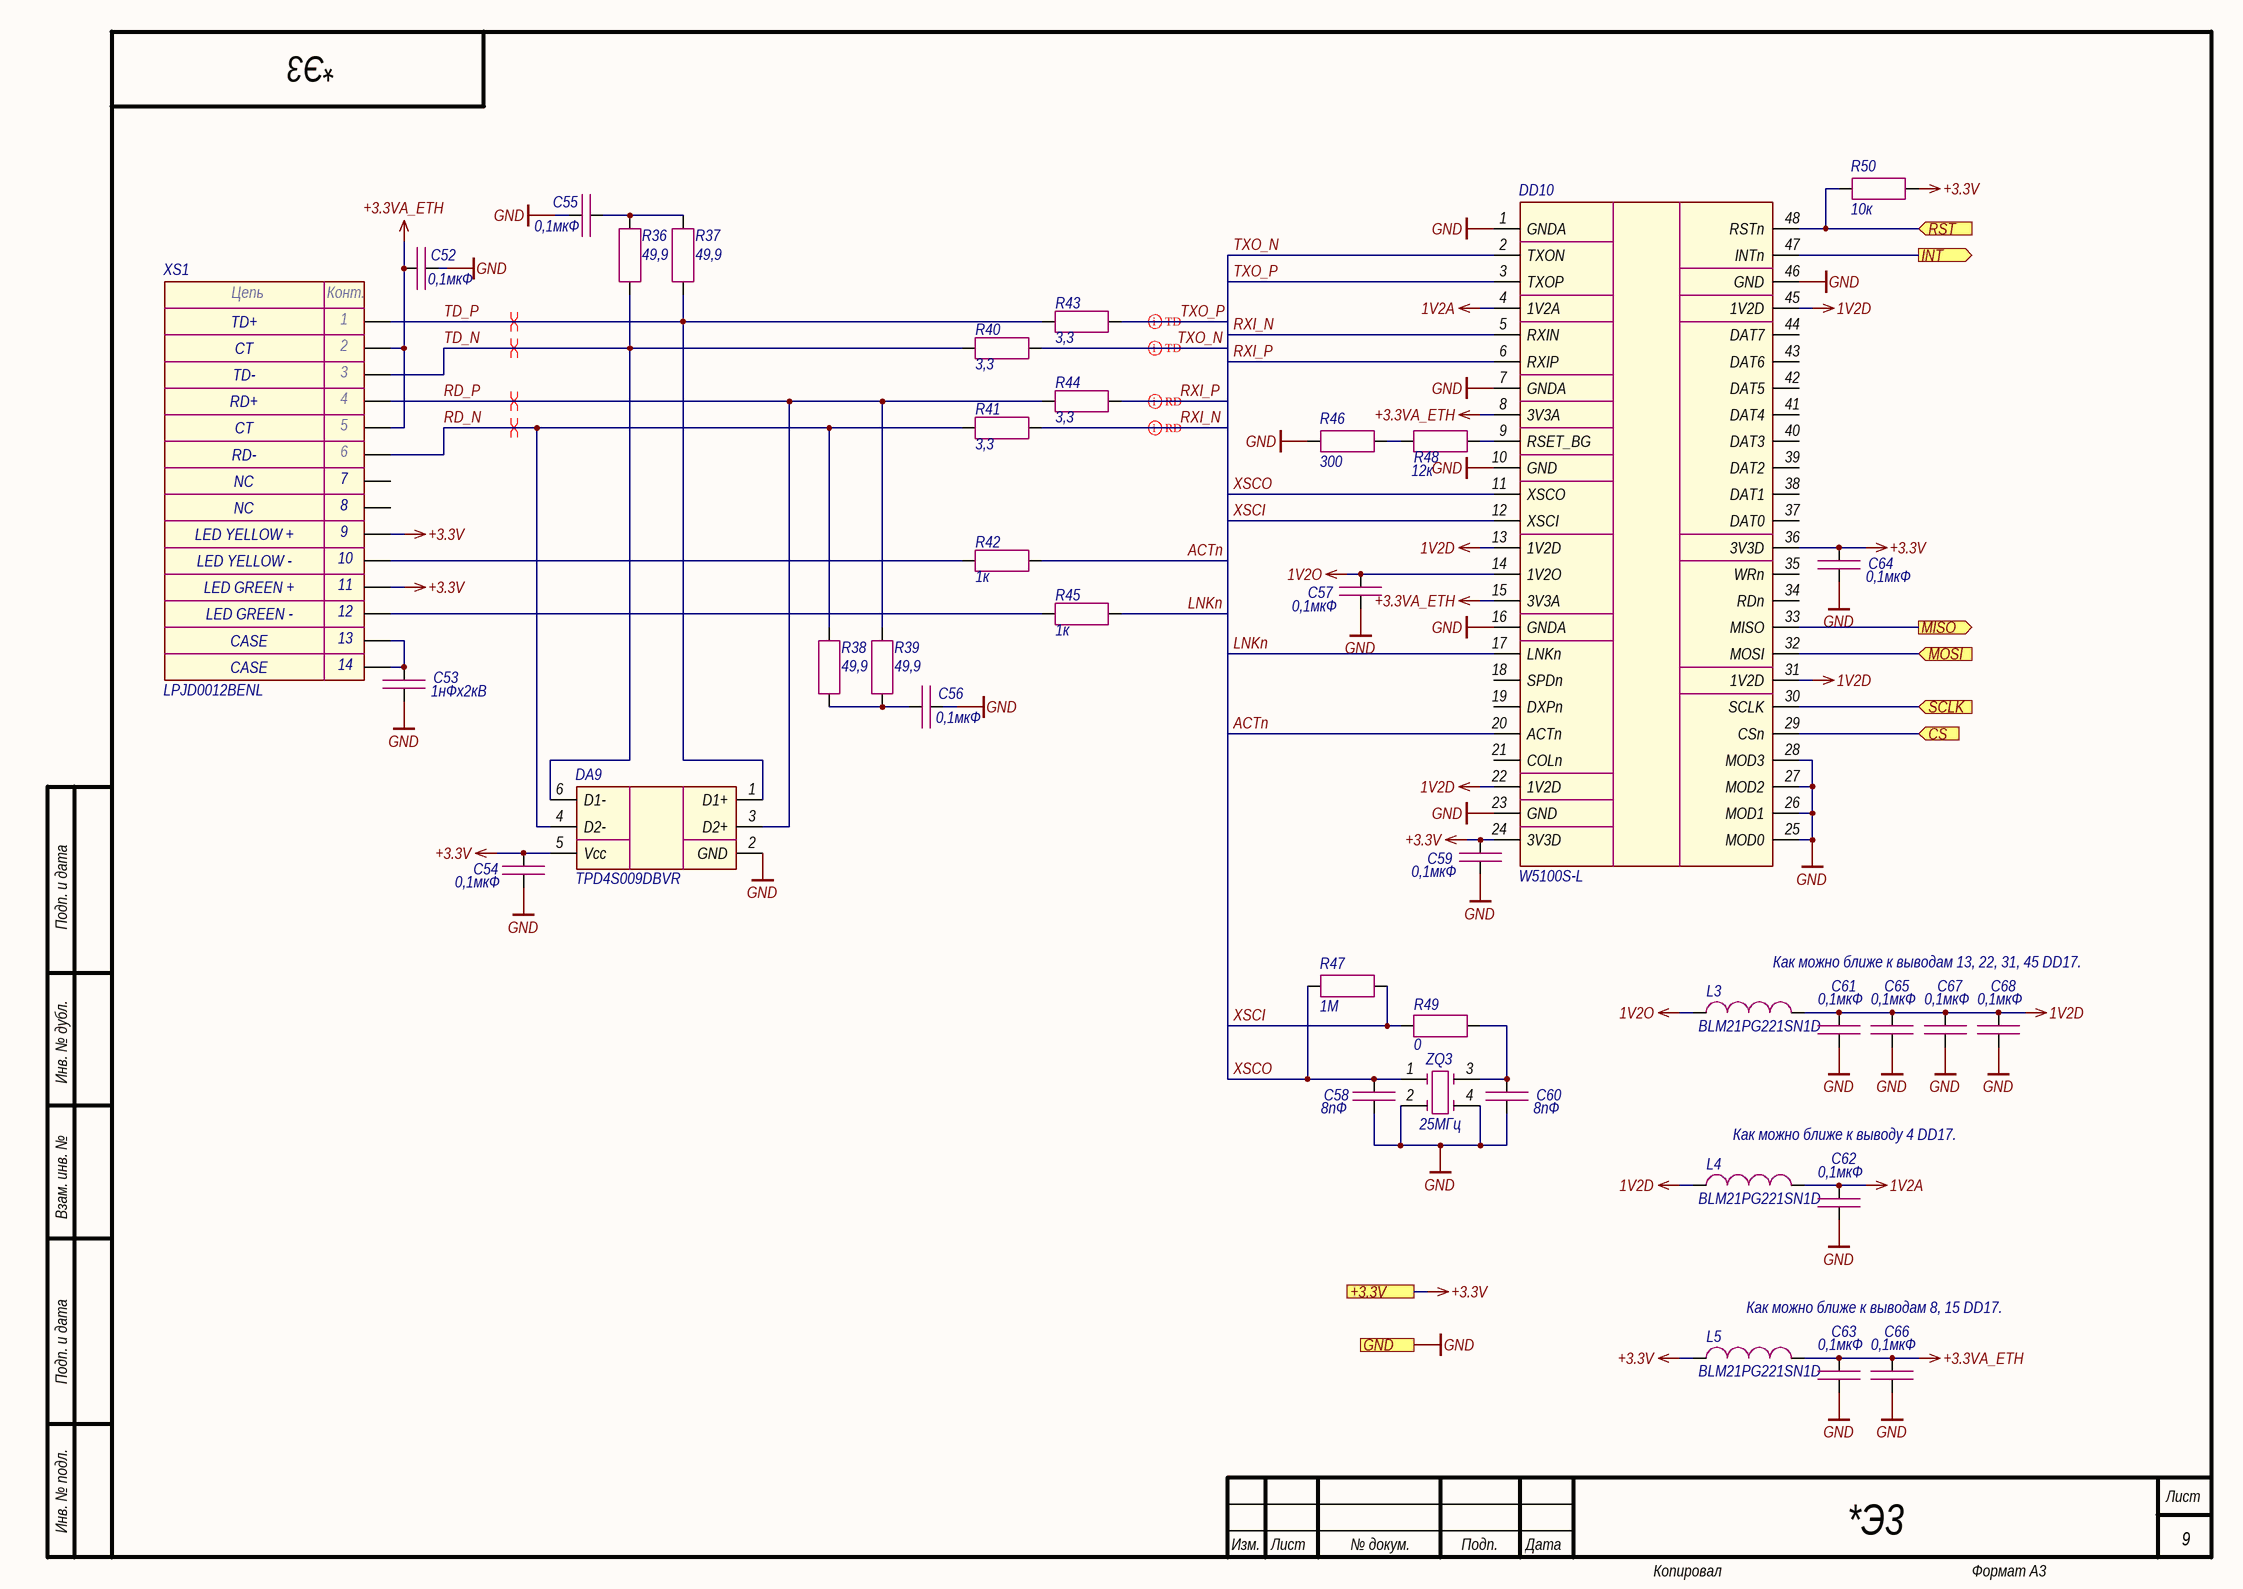
[diagram p3: Ethernet.SchDoc]

### Parts
C52  0,1мкФ  [CAP_0603]
C53  1нФх2кВ  [CAP_1206]
C54  0,1мкФ  [CAP_0603]
C55  0,1мкФ  [CAP_0603]
C56  0,1мкФ  [CAP_0603]
C57  0,1мкФ  [CAP_0603]
C58  8пФ  [CAP_0603]
C59  0,1мкФ  [CAP_0603]
C60  8пФ  [CAP_0603]
C61  0,1мкФ  [CAP_0603]
C62  0,1мкФ  [CAP_0603]
C63  0,1мкФ  [CAP_0603]
C64  0,1мкФ  [CAP_0603]
C65  0,1мкФ  [CAP_0603]
C66  0,1мкФ  [CAP_0603]
C67  0,1мкФ  [CAP_0603]
C68  0,1мкФ  [CAP_0603]
DA9  TPD4S009DBVR  [SOT-23-6]
DD10  W5100S-L  [LQFP-48]
L3  BLM21PG221SN1D  [IND_0805]
L4  BLM21PG221SN1D  [IND_0805]
L5  BLM21PG221SN1D  [IND_0805]
R36  49,9  [RES_0603]
R37  49,9  [RES_0603]
R38  49,9  [RES_0603]
R39  49,9  [RES_0603]
R40  3,3  [RES_0603]
R41  3,3  [RES_0603]
R42  1к  [RES_0603]
R43  3,3  [RES_0603]
R44  3,3  [RES_0603]
R45  1к  [RES_0603]
R46  300  [RES_0603]
R47  1М  [RES_0603]
R48  12к  [RES_0603]
R49  0  [RES_0603]
R50  10к  [RES_0603]
XS1  LPJD0012BENL  [LPJD0012BENL]
ZQ3  25МГц  [7M]

### Ports
+3.3V (see Main[3B], Bus[1D], Button[1D], Fiber_interlock[2C], Flow_sensor[2C], Hardwiring[3D]), CS (in, see Main[2B]), GND (see Main[3B], Bus[1D], Button[1D], Column[1C], Fiber_interlock[2C], Flow_sensor[2C], Guide_laser[1C], Hardwiring[3D], Indication[1C]), INT (out, see Main[3B]), MISO (out, see Main[2B]), MOSI (in, see Main[2B]), RST (in, see Main[3B]), SCLK (in, see Main[2B])

### Nets
1V2A: C62.1 DD10.4(1V2A) L4.2
1V2D: C61.1 C65.1 C67.1 C68.1 DD10.13(1V2D) DD10.22(1V2D) DD10.31(1V2D) DD10.45(1V2D) L3.2 L4.1
1V2O: C57.1 DD10.14(1V2O) L3.1
+3.3V: C54.1 C59.1 C64.1 DA9.5(Vcc) DD10.24(3V3D) DD10.36(3V3D) L5.1 R50.2 XS1.9 XS1.11 ; port +3.3V
+3.3VA_ETH: C52.1 C63.1 C66.1 DD10.8(3V3A) DD10.15(3V3A) L5.2 XS1.2 XS1.5
GND: C52.2 C53.2 C54.2 C55.2 C56.2 C57.2 C58.2 C59.2 C60.2 C61.2 C62.2 C63.2 C64.2 C65.2 C66.2 C67.2 C68.2 DA9.2(GND) DD10.1(GNDA) DD10.7(GNDA) DD10.10(GND) DD10.16(GNDA) DD10.23(GND) DD10.25(MOD0) DD10.26(MOD1) DD10.27(MOD2) DD10.28(MOD3) DD10.46(GND) R46.1 ZQ3.2 ZQ3.4 ; port GND
ACTn: DD10.20(ACTn) R42.2
ETH_CS: DD10.29(CSn) ; port CS
ETH_INT: DD10.47(INTn) ; port INT
ETH_MISO: DD10.33(MISO) ; port MISO
ETH_MOSI: DD10.32(MOSI) ; port MOSI
ETH_RST: DD10.48(RSTn) R50.1 ; port RST
ETH_SCLK: DD10.30(SCLK) ; port SCLK
LNKn: DD10.17(LNKn) R45.2
RD_N: DA9.4(D2-) R38.1 R41.2 XS1.6
RD_P: DA9.3(D2+) R39.1 R44.2 XS1.4
RXI_N: DD10.5(RXIN) R41.1
RXI_P: DD10.6(RXIP) R44.1
TD_N: DA9.6(D1-) R36.1 R40.2 XS1.3
TD_P: DA9.1(D1+) R37.1 R43.2 XS1.1
TXO_N: DD10.2(TXON) R40.1
TXO_P: DD10.3(TXOP) R43.1
XSCI: DD10.12(XSCI) R47.2 R49.1
XSCO: C58.1 DD10.11(XSCO) R47.1 ZQ3.1
NetC53_1: C53.1 XS1.13 XS1.14
NetC55_1: C55.1 R36.2 R37.2
NetC56_1: C56.1 R38.2 R39.2
NetC60_1: C60.1 R49.2 ZQ3.3
NetDD10_9: DD10.9(RSET_BG) R48.2
NetR42_1: R42.1 XS1.10
NetR45_1: R45.1 XS1.12
NetR46_2: R46.2 R48.1

Not connected (* = marked no-connect by the designer): DD10 18(SPDn) 19(DXPn) 21(COLn) 34(RDn) 35(WRn) 37(DAT0) 38(DAT1) 39(DAT2) 40(DAT3) 41(DAT4) 42(DAT5) 43(DAT6) 44(DAT7); XS1 7 8

### Layout directives
differential pair; differential pair class TD: TXO_N, TXO_P
differential pair; differential pair class RD: RXI_N, RXI_P
differential pair: RD_N, RD_P, TD_N, TD_P

### Notes on the sheet
- Как можно ближе к выводам 13, 22, 31, 45 DD17.
- Как можно ближе к выводу 4 DD17.
- Как можно ближе к выводам 8, 15 DD17.
- Подп. и дата
- Инв. № дубл.
- Взам. инв. №
- Инв. № подл.
- Изм.
- Лист
- № докум.
- Подп.
- Дата
- Копировал
- Формат А3
- (in symbol LPJD0012BENL) Цепь; Конт.; TD+; CT; TD-; RD+; RD-; NC; LED YELLOW +; LED YELLOW -; LED GREEN +; LED GREEN -; CASE

### Library data of the parts
C52 C54-C57 C59 C61-C68 = Capacitor: as C3 on sheet Main; Value: 0,1мкФ; Document: *
C53 = Capacitor: Manufacturer: Yageo; Model: CC1206KKX7RDBB102; Value: 1нФх2кВ; Document: *
C58 C60 = Capacitor: as C18 on sheet Main; Value: 8пФ; Document: *
DA9 = TPD4S009: Manufacturer: Texas Instruments; Model: TPD4S009DBVR; Document: *
DD10 = W5100S: Manufacturer: Wiznet; Model: W5100S-L; Document: *
L3-L5 = Inductor: Manufacturer: Murata; Value: *; Model: BLM21PG221SN1D; Document: *
R36-R39 = Resistor: Manufacturer: Yageo; Model: RC0603FR-0749R9L; Value: 49,9; Document: *
R40 R41 R43 R44 = Resistor: Manufacturer: Yageo; Model: RC0603FR-073R3L; Value: 3,3; Document: *
R42 R45 = Resistor: Manufacturer: Yageo; Model: RC0603FR-071KL; Value: 1к; Document: *
R46 = Resistor: Manufacturer: Yageo; Model: RC0603FR-07300RL; Value: 300; Document: *
R47 = Resistor: Manufacturer: Yageo; Model: RC0603FR-071ML; Value: 1М; Document: *
R48 = Resistor: Manufacturer: Yageo; Model: RC0603FR-0712KL; Value: 12к; Document: *
R49 = Resistor: Manufacturer: Yageo; Model: RC0603JR-070RL; Value: 0; Document: *
R50 = Resistor: as R3 on sheet Main; Value: 10к; Document: *
XS1 = LPJD0012BENL: Manufacturer: LINK-PP; Model: LPJD0012BENL; Document: *
ZQ3 = Quartz_Resonator_4-pin: Manufacturer: TXC; Model: 7M-25.000MAAJ-T; Value: 25МГц; Document: *

## Sheet Guide_laser.SchDoc
size 420 x 297 mm; Address1: Address1; Address2: Address2; Address3: Address3; Address4: Address4; DocumentNumber: *Э3; SheetNumber: 3; SheetTotal: 12; DocumentType: Схема электрическая *
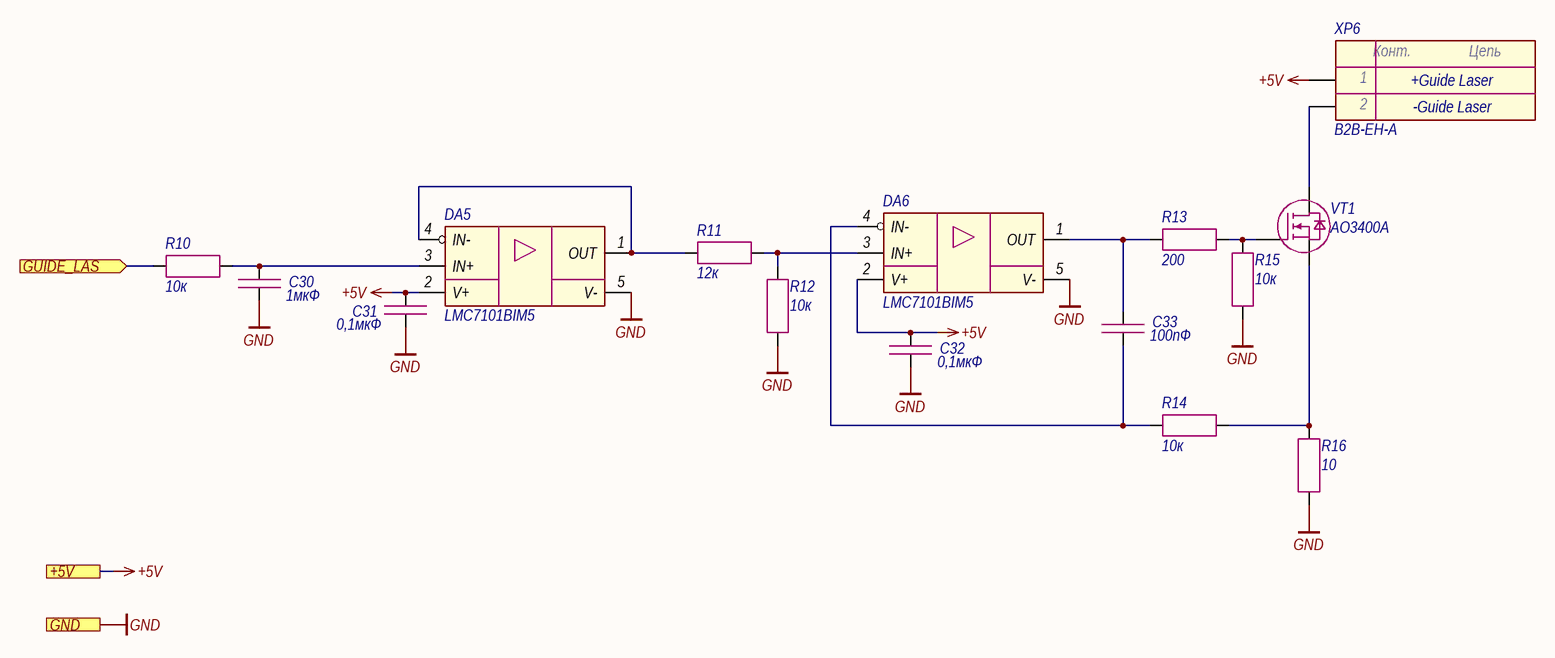
[diagram p4: Guide_laser.SchDoc]

### Parts
C30  1мкФ  [CAP_0603]
C31  0,1мкФ  [CAP_0603]
C32  0,1мкФ  [CAP_0603]
C33  100пФ  [CAP_0603]
DA5  LMC7101BIM5  [SOT-23-5]
DA6  LMC7101BIM5  [SOT-23-5]
R10  10к  [RES_0603]
R11  12к  [RES_0603]
R12  10к  [RES_0603]
R13  200  [RES_0603]
R14  10к  [RES_0603]
R15  10к  [RES_0603]
R16  10  [RES_1210]
VT1  AO3400A  [SOT-23-3]
XP6  B2B-EH-A  [B2B-EH-A]

### Ports
+5V (see Main[2A]), GND (see Main[2A], Bus[1D], Button[1D], Column[1C], Ethernet[3D], Fiber_interlock[2C], Flow_sensor[2C], Hardwiring[3D], Indication[1C]), GUIDE_LAS (in, see Main[3A])

### Nets
+5V: C31.1 C32.1 DA5.2(V+) DA6.2(V+) XP6.1 ; port +5V
GND: C30.2 C31.2 C32.2 DA5.5(V-) DA6.5(V-) R12.2 R15.1 R16.1 ; port GND
GUIDE_LAS: R10.1 ; port GUIDE_LAS
NetC30_1: C30.1 DA5.3(IN+) R10.2
NetC33_1: C33.1 DA6.1(OUT) R13.1
NetC33_2: C33.2 DA6.4(IN-) R14.1
NetDA5_1: DA5.1(OUT) DA5.4(IN-) R11.1
NetDA6_3: DA6.3(IN+) R11.2 R12.1
NetR13_2: R13.2 R15.2 VT1.1(G)
NetR14_2: R14.2 R16.2 VT1.2(S)
NetVT1_3: VT1.3(D) XP6.2

### Notes on the sheet
- +Guide Laser
- -Guide Laser
- Подп. и дата
- Инв. № дубл.
- Взам. инв. №
- Инв. № подл.
- Изм.
- Лист
- № докум.
- Подп.
- Дата
- Копировал
- Формат А3
- (in symbol Connector-2) Конт.; Цепь

### Library data of the parts
C30 = Capacitor: as C86 on sheet Hardwiring; Value: 1мкФ; Document: *
C31 C32 = Capacitor: as C3 on sheet Main; Value: 0,1мкФ; Document: *
C33 = Capacitor: as C73 on sheet Hardwiring; Value: 100пФ; Document: *
DA5 DA6 = LMC7101: Manufacturer: Texas Instruments; Model: LMC7101BIM5; Document: *
R10 R12 R14 R15 = Resistor: as R3 on sheet Main; Value: 10к; Document: *
R11 = Resistor: as R48 on sheet Ethernet; Value: 12к; Document: *
R13 = Resistor: as R5 on sheet Main; Value: 200; Document: *
R16 = Resistor: Manufacturer: Yageo; Model: RC1210FR-0710RL; Value: 10; Document: *
VT1 = MOSFET N-channel: Manufacturer: UMW; Model: AO3400A; Document: *
XP6 = Connector-2: Manufacturer: JST; Model: B2B-EH-A; Document: *

## Sheet Fiber_interlock.SchDoc
size 420 x 297 mm; Address1: Address1; Address2: Address2; Address3: Address3; Address4: Address4; DocumentNumber: *Э3; SheetNumber: 8; SheetTotal: 12; DocumentType: Схема электрическая *
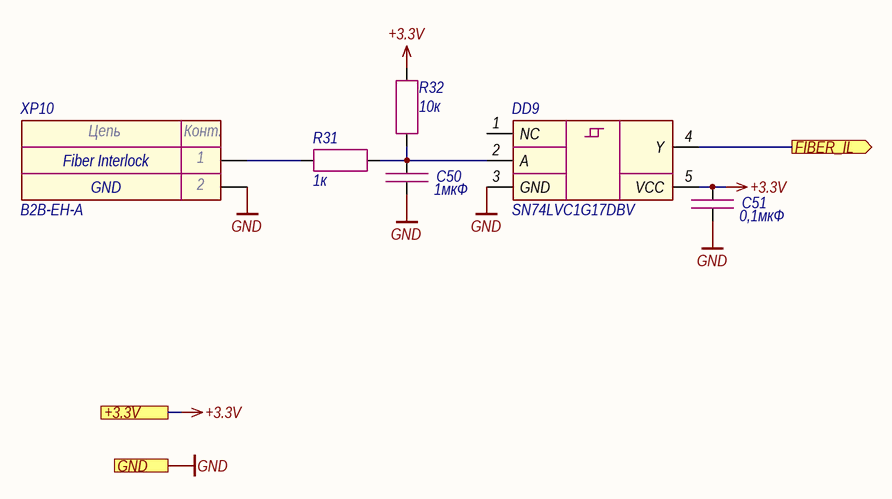
[diagram p5: Fiber_interlock.SchDoc]

### Parts
C50  1мкФ  [CAP_0603]
C51  0,1мкФ  [CAP_0603]
DD9  SN74LVC1G17DBV  [SOT-23-5]
R31  1к  [RES_0603]
R32  10к  [RES_0603]
XP10  B2B-EH-A  [B2B-EH-A]

### Ports
+3.3V (see Main[2A], Bus[1D], Button[1D], Ethernet[3D], Flow_sensor[2C], Hardwiring[3D]), FIBER_IL (out, see Main[3A]), GND (see Main[2A], Bus[1D], Button[1D], Column[1C], Ethernet[3D], Flow_sensor[2C], Guide_laser[1C], Hardwiring[3D], Indication[1C])

### Nets
+3.3V: C51.1 DD9.5(VCC) R32.2 ; port +3.3V
GND: C50.2 C51.2 DD9.3(GND) XP10.2 ; port GND
FIBER_IL: DD9.4(Y) ; port FIBER_IL
NetC50_1: C50.1 DD9.2(A) R31.2 R32.1
NetR31_1: R31.1 XP10.1

Not connected (* = marked no-connect by the designer): DD9 1(NC)

### Notes on the sheet
- (near XP10) Fiber Interlock
- GND
- Подп. и дата
- Инв. № дубл.
- Взам. инв. №
- Инв. № подл.
- Изм.
- Лист
- № докум.
- Подп.
- Дата
- Копировал
- Формат А3
- (in symbol Connector-2) Цепь; Конт.

### Library data of the parts
C50 = Capacitor: as C86 on sheet Hardwiring; Value: 1мкФ; Document: *
C51 = Capacitor: as C3 on sheet Main; Value: 0,1мкФ; Document: *
DD9 = SN74LVC1G17: Manufacturer: Texas Instruments; Model: SN74LVC1G17DBV; Document: *
R31 = Resistor: as R42 on sheet Ethernet; Value: 1к; Document: *
R32 = Resistor: as R3 on sheet Main; Value: 10к; Document: *
XP10 = Connector-2: Manufacturer: JST; Model: B2B-EH-A; Document: *

## Sheet Bus.SchDoc
size 420 x 297 mm; Address1: Address1; Address2: Address2; Address3: Address3; Address4: Address4; DocumentNumber: *Э*; SheetNumber: 2; SheetTotal: 12; DocumentType: Схема электрическая *
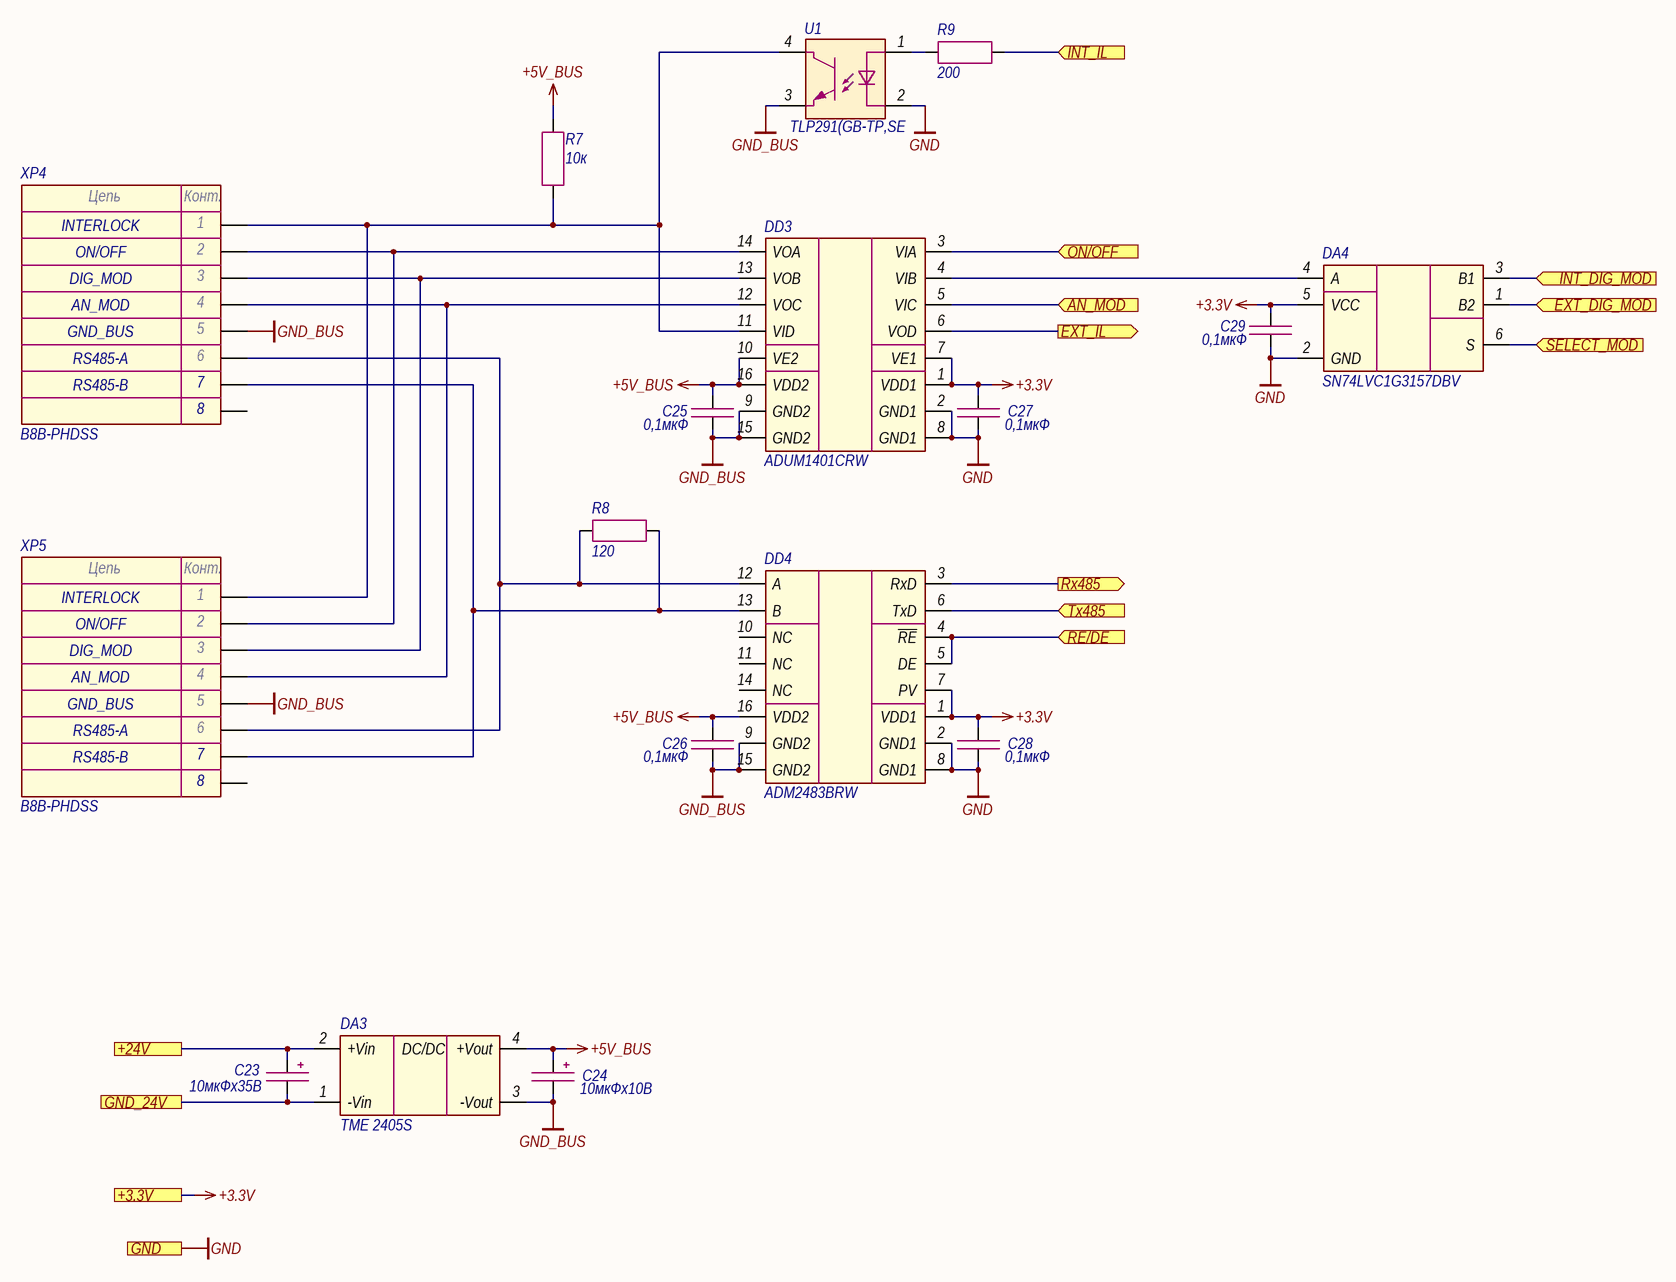
[diagram p6: Bus.SchDoc]

### Parts
C23  10мкФх35B  [CAP_C]
C24  10мкФх10B  [CAP_A]
C25  0,1мкФ  [CAP_0603]
C26  0,1мкФ  [CAP_0603]
C27  0,1мкФ  [CAP_0603]
C28  0,1мкФ  [CAP_0603]
C29  0,1мкФ  [CAP_0603]
DA3  TME 2405S  [TME (SIP-4)]
DA4  SN74LVC1G3157DBV  [SOT-23-6]
DD3  ADUM1401CRW  [SOIC-16W]
DD4  ADM2483BRW  [SOIC-16W]
R7  10к  [RES_0603]
R8  120  [RES_0805]
R9  200  [RES_0603]
U1  TLP291(GB-TP,SE  [11-3C1]
XP4  B8B-PHDSS  [B8B-PHDSS]
XP5  B8B-PHDSS  [B8B-PHDSS]

### Ports
+3.3V (see Main[1A], Button[1D], Ethernet[3D], Fiber_interlock[2C], Flow_sensor[2C], Hardwiring[3D]), +24V (see Main[1A], Button[1C], Column[1C], Flow_sensor[2C], Hardwiring[3C], Indication[1C]), AN_MOD (in, see Main[2A]), EXT_DIG_MOD (in, see Main[2A]), EXT_IL (out, see Main[2A]), GND (see Main[1A], Button[1D], Column[1C], Ethernet[3D], Fiber_interlock[2C], Flow_sensor[2C], Guide_laser[1C], Hardwiring[3D], Indication[1C]), GND_24V (see Main[1A], Button[1D], Column[1C], Flow_sensor[2C], Hardwiring[3C], Indication[1C]), INT_DIG_MOD (in, see Main[2A]), INT_IL (in, see Main[2A]), ON/OFF (in, see Main[2A]), RE/DE (in, see Main[1A]), Rx485 (out, see Main[1A]), SELECT_MOD (in, see Main[2A]), Tx485 (in, see Main[1A])

### Nets
+3.3V: C27.1 C28.1 C29.1 DA4.5(VCC) DD3.1(VDD1) DD3.7(VE1) DD4.1(VDD1) DD4.7(PV) ; port +3.3V
+5V_BUS: C24.1 C25.1 C26.1 DA3.4(+Vout) DD3.10(VE2) DD3.16(VDD2) DD4.16(VDD2) R7.1
+24V: C23.1 DA3.2(+Vin) ; port +24V
GND: C27.2 C28.2 C29.2 DA4.2(GND) DD3.2(GND1) DD3.8(GND1) DD4.2(GND1) DD4.8(GND1) U1.2 ; port GND
GND_24V: C23.2 DA3.1(-Vin) ; port GND_24V
GND_BUS: C24.2 C25.2 C26.2 DA3.3(-Vout) DD3.9(GND2) DD3.15(GND2) DD4.9(GND2) DD4.15(GND2) U1.3 XP4.5 XP5.5
AN_MOD: DD3.5(VIC) ; port AN_MOD
BUS_IL: DD3.6(VOD) ; port EXT_IL
DIG_MOD: DA4.3(B1) ; port INT_DIG_MOD
DRV_ON: DD3.3(VIA) ; port ON/OFF
EMER_BUT: R9.1 ; port INT_IL
EXT_DIG_MOD: DA4.1(B2) ; port EXT_DIG_MOD
RE/DE: DD4.4(~{RE}) DD4.5(DE) ; port RE/DE
Rx485: DD4.3(RxD) ; port Rx485
SEL_MOD: DA4.6(S) ; port SELECT_MOD
Tx485: DD4.6(TxD) ; port Tx485
NetDA4_4: DA4.4(A) DD3.4(VIB)
NetDD3_11: DD3.11(VID) R7.2 U1.4 XP4.1 XP5.1
NetDD3_12: DD3.12(VOC) XP4.4 XP5.4
NetDD3_13: DD3.13(VOB) XP4.3 XP5.3
NetDD3_14: DD3.14(VOA) XP4.2 XP5.2
NetDD4_12: DD4.12(A) R8.1 XP4.6 XP5.6
NetDD4_13: DD4.13(B) R8.2 XP4.7 XP5.7
NetR9_2: R9.2 U1.1

Not connected (* = marked no-connect by the designer): DD4 10(NC) 11(NC) 14(NC); XP4 8; XP5 8

### Notes on the sheet
- INTERLOCK
- DIG_MOD
- ON/OFF
- AN_MOD
- RS485-A
- GND_BUS
- RS485-B
- Подп. и дата
- Инв. № дубл.
- Взам. инв. №
- Инв. № подл.
- Изм.
- Лист
- № докум.
- Подп.
- Дата
- Копировал
- Формат А3
- (in symbol Connector-8) Цепь; Конт.
- (in symbol TME) DC/DC

### Library data of the parts
C23 = Capacitor_Polar: Model: TECAP, 10 мкФ, 35 В, тип C, 10%; Value: 10мкФх35B; Document: *; Manufacturer: *
C24 = Capacitor_Polar: Model: TECAP, 10 мкФ, 10 В, тип A, 10%; Value: 10мкФх10B; Document: *; Manufacturer: *
C25-C29 = Capacitor: as C3 on sheet Main; Value: 0,1мкФ; Document: *
DA3 = TME: Manufacturer: Traco Power; Model: TME 2405S; Document: *
DA4 = SN74LVC1G3157: Manufacturer: Texas Instruments; Model: SN74LVC1G3157DBV; Document: *
DD3 = ADUM1401: Manufacturer: Analog Devices; Model: ADUM1401CRW; Document: *
DD4 = ADM2483BRW: Manufacturer: Analog Devices; Model: ADM2483BRW; Document: *
R7 = Resistor: as R3 on sheet Main; Value: 10к; Document: *
R8 = Resistor: Manufacturer: Yageo; Model: RC0805FR-07120RL; Value: 120; Document: *
R9 = Resistor: as R5 on sheet Main; Value: 200; Document: *
U1 = TLP291: Manufacturer: Toshiba; Model: TLP291(GB-TP,SE; Document: *
XP4 XP5 = Connector-8: Manufacturer: JST; Model: B8B-PHDSS; Document: *

## Sheet Flow_sensor.SchDoc
size 420 x 297 mm; Address1: Address1; Address2: Address2; Address3: Address3; Address4: Address4; DocumentNumber: *Э3; SheetNumber: 4; SheetTotal: 12; DocumentType: Схема электрическая *
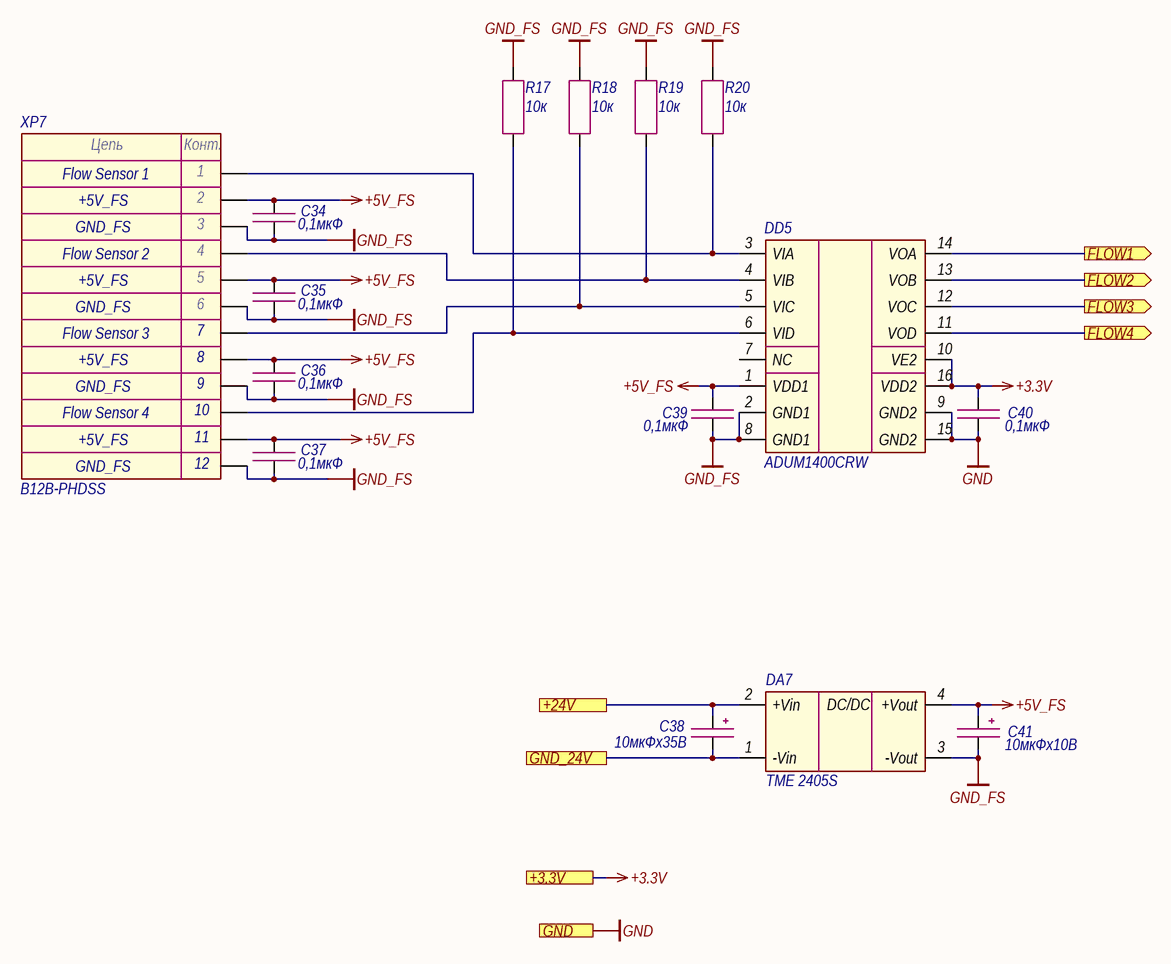
[diagram p7: Flow_sensor.SchDoc]

### Parts
C34  0,1мкФ  [CAP_0603]
C35  0,1мкФ  [CAP_0603]
C36  0,1мкФ  [CAP_0603]
C37  0,1мкФ  [CAP_0603]
C38  10мкФх35B  [CAP_C]
C39  0,1мкФ  [CAP_0603]
C40  0,1мкФ  [CAP_0603]
C41  10мкФх10B  [CAP_A]
DA7  TME 2405S  [TME (SIP-4)]
DD5  ADUM1400CRW  [SOIC-16W]
R17  10к  [RES_0603]
R18  10к  [RES_0603]
R19  10к  [RES_0603]
R20  10к  [RES_0603]
XP7  B12B-PHDSS  [B12B-PHDSS]

### Ports
+3.3V (see Main[1B], Bus[1D], Button[1D], Ethernet[3D], Fiber_interlock[2C], Hardwiring[3D]), +24V (see Main[1A], Bus[1D], Button[1C], Column[1C], Hardwiring[3C], Indication[1C]), FLOW1 (out, see Main[2A]), FLOW2 (out, see Main[2A]), FLOW3 (out, see Main[2B]), FLOW4 (out, see Main[2B]), GND (see Main[1B], Bus[1D], Button[1D], Column[1C], Ethernet[3D], Fiber_interlock[2C], Guide_laser[1C], Hardwiring[3D], Indication[1C]), GND_24V (see Main[1A], Bus[1D], Button[1D], Column[1C], Hardwiring[3C], Indication[1C])

### Nets
+3.3V: C40.1 DD5.10(VE2) DD5.16(VDD2) ; port +3.3V
+5V_FS: C34.1 C35.1 C36.1 C37.1 C39.1 C41.1 DA7.4(+Vout) DD5.1(VDD1) XP7.2 XP7.5 XP7.8 XP7.11
+24V: C38.1 DA7.2(+Vin) ; port +24V
GND: C40.2 DD5.9(GND2) DD5.15(GND2) ; port GND
GND_24V: C38.2 DA7.1(-Vin) ; port GND_24V
GND_FS: C34.2 C35.2 C36.2 C37.2 C39.2 C41.2 DA7.3(-Vout) DD5.2(GND1) DD5.8(GND1) R17.2 R18.2 R19.2 R20.2 XP7.3 XP7.6 XP7.9 XP7.12
FLOW1: DD5.14(VOA) ; port FLOW1
FLOW2: DD5.13(VOB) ; port FLOW2
FLOW3: DD5.12(VOC) ; port FLOW3
FLOW4: DD5.11(VOD) ; port FLOW4
NetDD5_3: DD5.3(VIA) R20.1 XP7.1
NetDD5_4: DD5.4(VIB) R19.1 XP7.4
NetDD5_5: DD5.5(VIC) R18.1 XP7.7
NetDD5_6: DD5.6(VID) R17.1 XP7.10

Not connected (* = marked no-connect by the designer): DD5 7(NC)

### Notes on the sheet
- Flow Sensor 1
- +5V_FS
- GND_FS
- Flow Sensor 2
- Flow Sensor 3
- Flow Sensor 4
- Подп. и дата
- Инв. № дубл.
- Взам. инв. №
- Инв. № подл.
- Изм.
- Лист
- № докум.
- Подп.
- Дата
- Копировал
- Формат А3
- (in symbol Connector-12) Цепь; Конт.
- (in symbol TME) DC/DC

### Library data of the parts
C34-C37 C39 C40 = Capacitor: as C3 on sheet Main; Value: 0,1мкФ; Document: *
C38 = Capacitor_Polar: Model: TECAP, 10 мкФ, 35 В, тип C, 10%; Value: 10мкФх35B; Document: *; Manufacturer: *
C41 = Capacitor_Polar: Model: TECAP, 10 мкФ, 10 В, тип A, 10%; Value: 10мкФх10B; Document: *; Manufacturer: *
DA7 = TME: Manufacturer: Traco Power; Model: TME 2405S; Document: *
DD5 = ADUM1400: Manufacturer: Analog Devices; Model: ADUM1400CRW; Document: *
R17-R20 = Resistor: as R3 on sheet Main; Value: 10к; Document: *
XP7 = Connector-12: Manufacturer: JST; Model: B12B-PHDSS; Document: *

## Sheet Button.SchDoc
size 420 x 297 mm; Address1: Address1; Address2: Address2; Address3: Address3; Address4: Address4; DocumentNumber: *Э3; SheetNumber: 5; SheetTotal: 12; DocumentType: Схема электрическая *
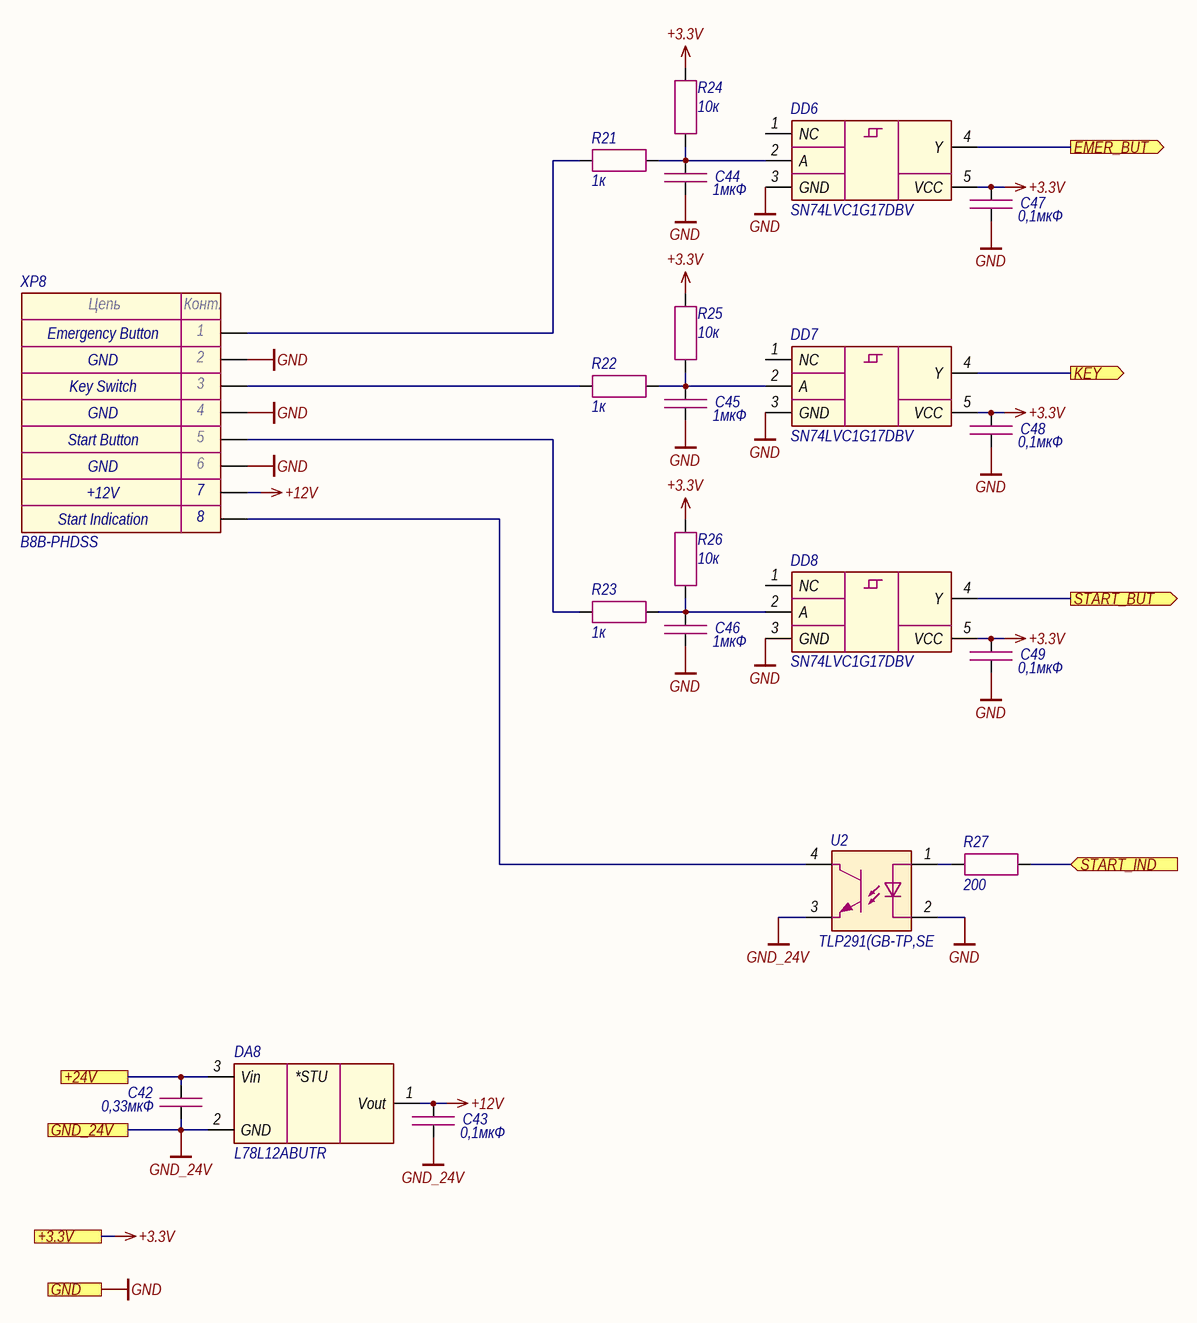
[diagram p8: Button.SchDoc]

### Parts
C42  0,33мкФ  [CAP_0805]
C43  0,1мкФ  [CAP_0603]
C44  1мкФ  [CAP_0603]
C45  1мкФ  [CAP_0603]
C46  1мкФ  [CAP_0603]
C47  0,1мкФ  [CAP_0603]
C48  0,1мкФ  [CAP_0603]
C49  0,1мкФ  [CAP_0603]
DA8  L78L12ABUTR  [SOT-89]
DD6  SN74LVC1G17DBV  [SOT-23-5]
DD7  SN74LVC1G17DBV  [SOT-23-5]
DD8  SN74LVC1G17DBV  [SOT-23-5]
R21  1к  [RES_0603]
R22  1к  [RES_0603]
R23  1к  [RES_0603]
R24  10к  [RES_0603]
R25  10к  [RES_0603]
R26  10к  [RES_0603]
R27  200  [RES_0603]
U2  TLP291(GB-TP,SE  [11-3C1]
XP8  B8B-PHDSS  [B8B-PHDSS]

### Ports
+3.3V (see Main[1B], Bus[1D], Ethernet[3D], Fiber_interlock[2C], Flow_sensor[2C], Hardwiring[3D]), +24V (see Main[1B], Bus[1D], Column[1C], Flow_sensor[2C], Hardwiring[3C], Indication[1C]), EMER_BUT (out, see Main[2B]), GND (see Main[1B], Bus[1D], Column[1C], Ethernet[3D], Fiber_interlock[2C], Flow_sensor[2C], Guide_laser[1C], Hardwiring[3D], Indication[1C]), GND_24V (see Main[1B], Bus[1D], Column[1C], Flow_sensor[2C], Hardwiring[3C], Indication[1C]), KEY (out, see Main[2B]), START_BUT (out, see Main[2B]), START_IND (in, see Main[2B])

### Nets
+3.3V: C47.1 C48.1 C49.1 DD6.5(VCC) DD7.5(VCC) DD8.5(VCC) R24.2 R25.2 R26.2 ; port +3.3V
+12V: C43.1 DA8.1(Vout) XP8.7
+24V: C42.2 DA8.3(Vin) ; port +24V
GND: C44.2 C45.2 C46.2 C47.2 C48.2 C49.2 DD6.3(GND) DD7.3(GND) DD8.3(GND) U2.2 XP8.2 XP8.4 XP8.6 ; port GND
GND_24V: C42.1 C43.2 DA8.2(GND) U2.3 ; port GND_24V
EMER_BUT: DD6.4(Y) ; port EMER_BUT
KEY: DD7.4(Y) ; port KEY
START_BUT: DD8.4(Y) ; port START_BUT
START_IND: R27.2 ; port START_IND
NetC44_1: C44.1 DD6.2(A) R21.2 R24.1
NetC45_1: C45.1 DD7.2(A) R22.2 R25.1
NetC46_1: C46.1 DD8.2(A) R23.2 R26.1
NetR21_1: R21.1 XP8.1
NetR22_1: R22.1 XP8.3
NetR23_1: R23.1 XP8.5
NetR27_1: R27.1 U2.1
NetU2_4: U2.4 XP8.8

Not connected (* = marked no-connect by the designer): DD6 1(NC); DD7 1(NC); DD8 1(NC)

### Notes on the sheet
- GND
- (near XP8) Emergency Button
- Start Button
- Key Switch
- +12V
- (near XP8) Start Indication
- Подп. и дата
- Инв. № дубл.
- Взам. инв. №
- Инв. № подл.
- Изм.
- Лист
- № докум.
- Подп.
- Дата
- Копировал
- Формат А3
- (in symbol Connector-8) Цепь; Конт.
- (in symbol LD2981ABU50TR) *STU

### Library data of the parts
C42 = Capacitor: as C82 on sheet Hardwiring; Value: 0,33мкФ; Document: *
C43 C47-C49 = Capacitor: as C3 on sheet Main; Value: 0,1мкФ; Document: *
C44-C46 = Capacitor: as C86 on sheet Hardwiring; Value: 1мкФ; Document: *
DA8 = LD2981ABU50TR: Manufacturer: STMicroelectronics; Model: L78L12ABUTR; Document: *
DD6-DD8 = SN74LVC1G17: Manufacturer: Texas Instruments; Model: SN74LVC1G17DBV; Document: *
R21-R23 = Resistor: as R42 on sheet Ethernet; Value: 1к; Document: *
R24-R26 = Resistor: as R3 on sheet Main; Value: 10к; Document: *
R27 = Resistor: as R5 on sheet Main; Value: 200; Document: *
U2 = TLP291: Manufacturer: Toshiba; Model: TLP291(GB-TP,SE; Document: *
XP8 = Connector-8: Manufacturer: JST; Model: B8B-PHDSS; Document: *

## Sheet Column.SchDoc
size 420 x 297 mm; Address1: Address1; Address2: Address2; Address3: Address3; Address4: Address4; DocumentNumber: *Э3; SheetNumber: 7; SheetTotal: 12; DocumentType: Схема электрическая *
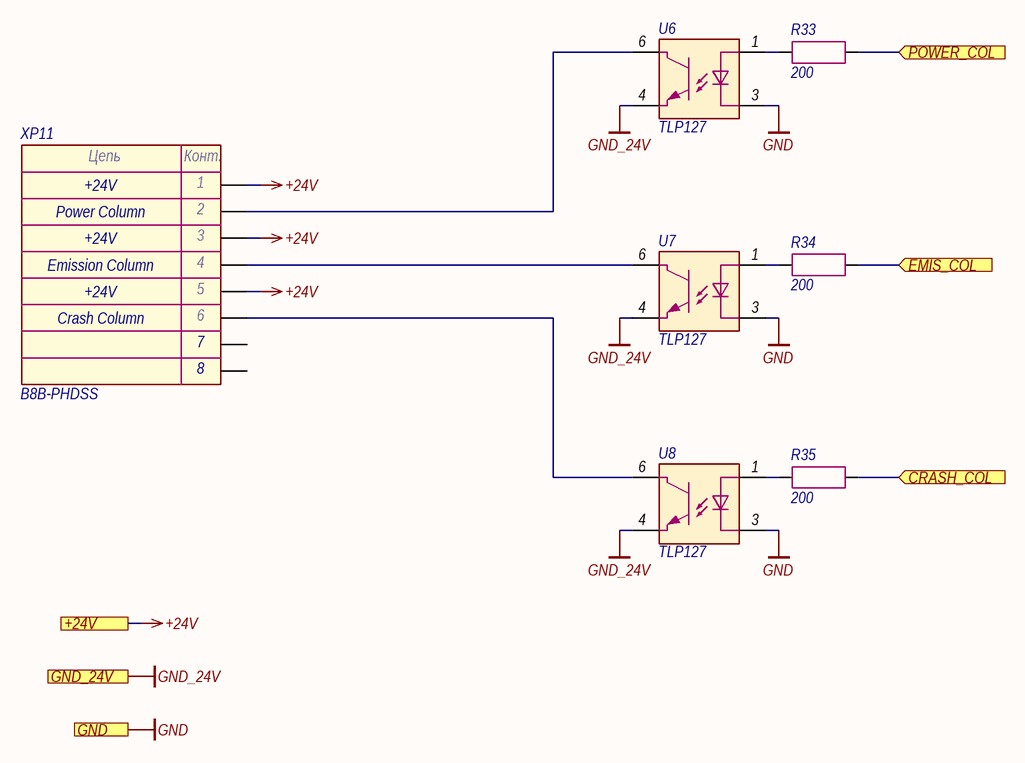
[diagram p9: Column.SchDoc]

### Parts
R33  200  [RES_0603]
R34  200  [RES_0603]
R35  200  [RES_0603]
U6  TLP127  [11-4C1]
U7  TLP127  [11-4C1]
U8  TLP127  [11-4C1]
XP11  B8B-PHDSS  [B8B-PHDSS]

### Ports
+24V (see Main[1B], Bus[1D], Button[1C], Flow_sensor[2C], Hardwiring[3C], Indication[1C]), CRASH_COL (in, see Main[2B]), EMIS_COL (in, see Main[2B]), GND (see Main[1B], Bus[1D], Button[1D], Ethernet[3D], Fiber_interlock[2C], Flow_sensor[2C], Guide_laser[1C], Hardwiring[3D], Indication[1C]), GND_24V (see Main[1B], Bus[1D], Button[1D], Flow_sensor[2C], Hardwiring[3C], Indication[1C]), POWER_COL (in, see Main[2B])

### Nets
+24V: XP11.1 XP11.3 XP11.5 ; port +24V
GND: U6.3 U7.3 U8.3 ; port GND
GND_24V: U6.4 U7.4 U8.4 ; port GND_24V
CRASH_COL: R35.2 ; port CRASH_COL
EMIS_COL: R34.2 ; port EMIS_COL
POWER_COL: R33.2 ; port POWER_COL
NetR33_1: R33.1 U6.1
NetR34_1: R34.1 U7.1
NetR35_1: R35.1 U8.1
NetU6_6: U6.6 XP11.2
NetU7_6: U7.6 XP11.4
NetU8_6: U8.6 XP11.6

Not connected (* = marked no-connect by the designer): XP11 7 8

### Notes on the sheet
- Power Column
- +24V
- Emission Column
- Crash Column
- Подп. и дата
- Инв. № дубл.
- Взам. инв. №
- Инв. № подл.
- Изм.
- Лист
- № докум.
- Подп.
- Дата
- Копировал
- Формат А3
- (in symbol Connector-8) Цепь; Конт.

### Library data of the parts
R33-R35 = Resistor: as R5 on sheet Main; Value: 200; Document: *
U6-U8 = TLP127: Manufacturer: Toshiba; Model: TLP127; Document: *
XP11 = Connector-8: Manufacturer: JST; Model: B8B-PHDSS; Document: *

## Sheet Thermistor.SchDoc
size 209 x 297 mm; Address1: Address1; Address2: Address2; Address3: Address3; Address4: Address4; DocumentNumber: *Э3; SheetNumber: 12; SheetTotal: 12; DocumentType: Схема электрическая *
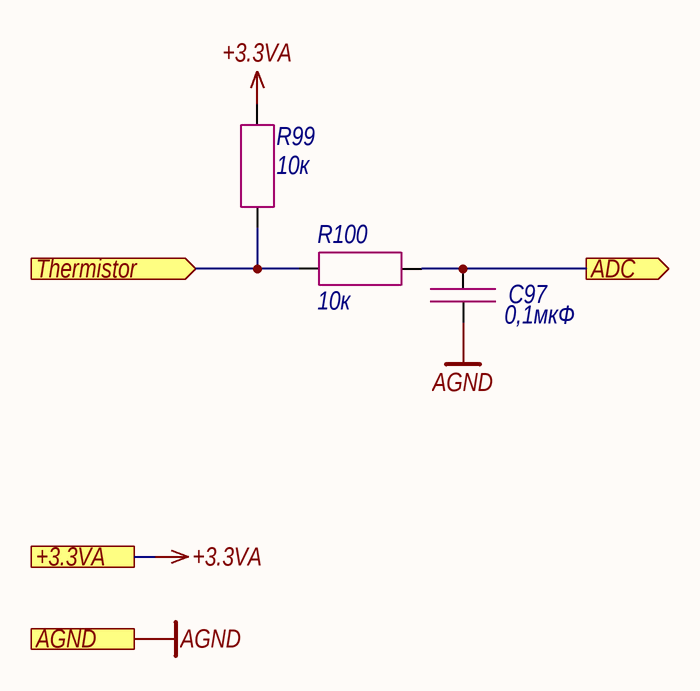
[diagram p10: Thermistor.SchDoc]

### Parts
C97  0,1мкФ  [CAP_0603]
R99  10к  [RES_0603]
R100  10к  [RES_0603]

### Ports
+3.3VA (see Main[2C], Hardwiring[4D]), ADC (out, see Main[3C]), AGND (see Main[2C], Hardwiring[4D], Photodiode[1C]), Thermistor (in, see Main[2C])

### Nets
+3.3VA: R99.1 ; port +3.3VA
AGND: C97.2 ; port AGND
T1: R99.2 R100.1 ; port Thermistor
T1_ADC: C97.1 R100.2 ; port ADC

### Notes on the sheet
- Подп. и дата
- Инв. № дубл.
- Взам. инв. №
- Инв. № подл.
- Изм.
- Лист
- № докум.
- Подп.
- Дата
- Копировал
- Формат А4

### Library data of the parts
C97 = Capacitor: as C3 on sheet Main; Value: 0,1мкФ; Document: *
R99 R100 = Resistor: as R3 on sheet Main; Value: 10к; Document: *

## Sheet Photodiode.SchDoc
size 420 x 297 mm; Address1: Address1; Address2: Address2; Address3: Address3; Address4: Address4; DocumentNumber: *Э3; SheetNumber: 11; SheetTotal: 12; DocumentType: Схема электрическая *
Used 2 times, as channels A10, A12. Parts and nets are listed once, with the designators drawn on the sheet.
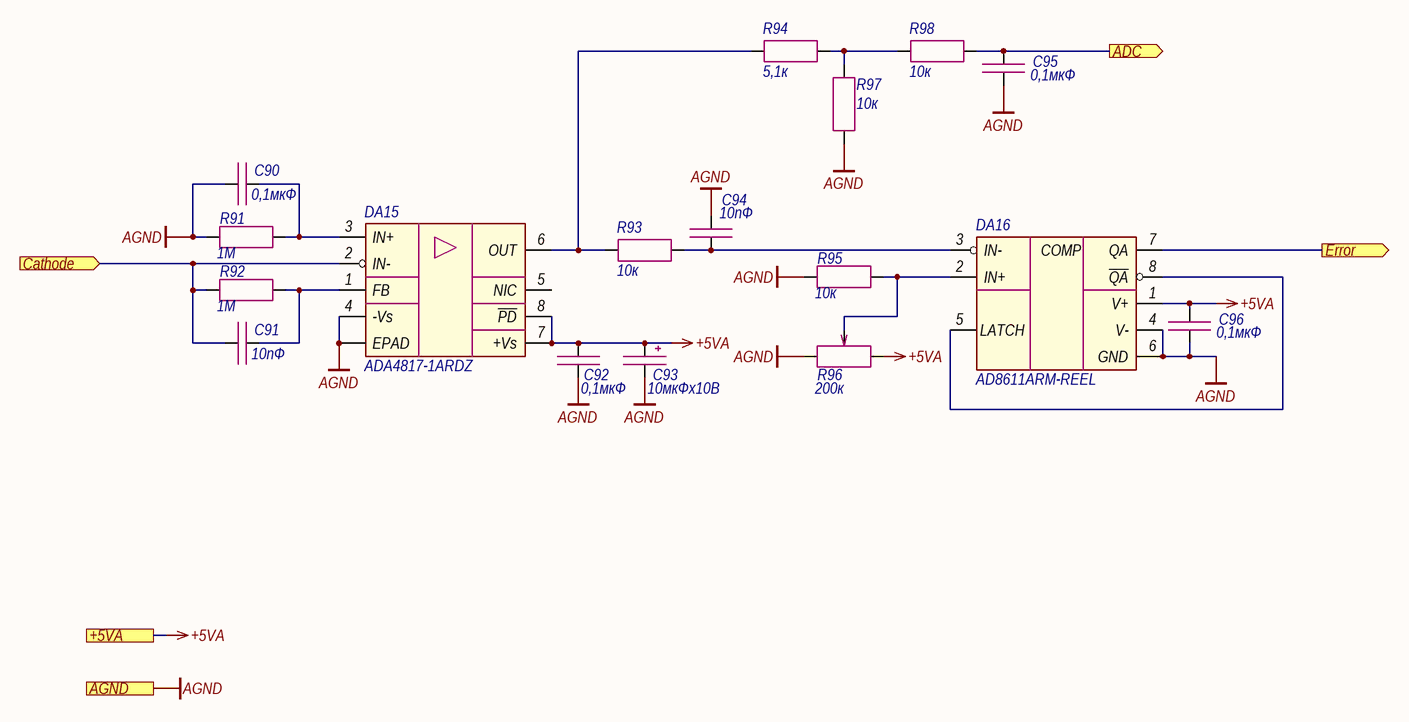
[diagram p11: Photodiode.SchDoc]

### Parts
C90  0,1мкФ  [CAP_0603]
C91  10пФ  [CAP_0603]
C92  0,1мкФ  [CAP_0603]
C93  10мкФх10B  [CAP_A]
C94  10пФ  [CAP_0603]
C95  0,1мкФ  [CAP_0603]
C96  0,1мкФ  [CAP_0603]
DA15  ADA4817-1ARDZ  [SOIC-8 EPAD]
DA16  AD8611ARM-REEL  [MSOP-8]
R91  1М  [RES_0805]
R92  1М  [RES_0805]
R93  10к  [RES_0603]
R94  5,1к  [RES_0603]
R95  10к  [RES_0603]
R96  200к  [3224W]
R97  10к  [RES_0603]
R98  10к  [RES_0603]

### Ports
+5VA (see Main[2C]), ADC (out, see Main[3C]), AGND (see Main[2C], Hardwiring[4D], Thermistor[2C]), Cathode (in, see Main[2C]), Error (out, see Main[3C])

### Nets
+5VA: C92.1 C93.1 C96.1 DA15.7(+Vs) DA15.8(~{PD}) DA16.1(V+) R96.3 ; port +5VA
AGND: C90.1 C92.2 C93.2 C94.2 C95.2 C96.2 DA15.4(-Vs) DA15.EPAD DA16.4(V-) DA16.6(GND) R91.2 R95.1 R96.1 R97.2 ; port AGND
ADC: C95.1 R98.2 ; port ADC
Cathode: C91.2 DA15.2(IN-) R92.2 ; port Cathode
Error: DA16.7(QA) ; port Error
NetC90_2: C90.2 DA15.3(IN+) R91.1
NetC91_1: C91.1 DA15.1(FB) R92.1
NetC94_1: C94.1 DA16.3(IN-) R93.2
NetDA15_6: DA15.6(OUT) R93.1 R94.1
NetDA16_2: DA16.2(IN+) R95.2 R96.2
NetDA16_5: DA16.5(LATCH) DA16.8(~{QA})
NetR94_2: R94.2 R97.1 R98.1

Not connected (* = marked no-connect by the designer): DA15 5(NIC)

### Channels
A10: designators end in A10; ports +5VA=+5VA ADC=PD1_ADC AGND=AGND Cathode=PD1 Error=PD1_ERR
A12: designators end in A12; ports +5VA=+5VA ADC=PD2_ADC AGND=AGND Cathode=PD2 Error=PD2_ERR

### Notes on the sheet
- Подп. и дата
- Инв. № дубл.
- Взам. инв. №
- Инв. № подл.
- Изм.
- Лист
- № докум.
- Подп.
- Дата
- Копировал
- Формат А3
- (in symbol AD8611) COMP

### Library data of the parts
C90 C92 C95 C96 = Capacitor: as C3 on sheet Main; Value: 0,1мкФ; Document: *
C91 C94 = Capacitor: Manufacturer: Murata; Model: GRM1885C1H100JA01D; Value: 10пФ; Document: *
C93 = Capacitor_Polar: Model: TECAP, 10 мкФ, 10 В, тип A, 10%; Value: 10мкФх10B; Document: *; Manufacturer: *
DA15 = ADA4817-1ARDZ: Manufacturer: Analog Devices; Model: ADA4817-1ARDZ; Document: *
DA16 = AD8611: Manufacturer: Analog Devices; Model: AD8611ARM-REEL; Document: *
R91 R92 = Resistor: Manufacturer: Yageo; Model: RC0805FR-071ML; Value: 1М; Document: *
R93 R95 R97 R98 = Resistor: as R3 on sheet Main; Value: 10к; Document: *
R94 = Resistor: Manufacturer: Yageo; Model: RC0603FR-075K1L; Value: 5,1к; Document: *
R96 = Resistor_Variable: Manufacturer: Bourns; Model: 3224W-1-204E; Value: 200к; Document: *

## Nets that join several sheets
+3.3V: Main (20 pins), Hardwiring (12 pins), Ethernet (10 pins), Fiber_interlock (C51.1 DD9.5 R32.2), Bus (8 pins), Flow_sensor (C40.1 DD5.10 DD5.16), Button (9 pins)
+3.3VA: Main (6 pins), Hardwiring (C78.1 DA11.2 U10.6), Thermistor (R99.1)
+5V: Main (5 pins), Guide_laser (5 pins)
+5VA: Main (C3.1 L1.2), A10 (7 pins), A12 (7 pins)
+24V: Main (C1.1 DA1.2 XP2.1), Indication (XP9.1 XP9.3 XP9.5), Hardwiring (C81.1 DA12.2), Bus (C23.1 DA3.2), Flow_sensor (C38.1 DA7.2), Button (C42.2 DA8.3), Column (XP11.1 XP11.3 XP11.5)
AGND: Main (10 pins), Hardwiring (C78.2 C79.2 DA11.5 R76.2), Thermistor (C97.2), A10 (14 pins), A12 (14 pins)
GND: Main (38 pins), Indication (U3.2 U4.2 U5.2), Hardwiring (15 pins), Ethernet (31 pins), Guide_laser (8 pins), Fiber_interlock (C50.2 C51.2 DD9.3 XP10.2), Bus (9 pins), Flow_sensor (C40.2 DD5.9 DD5.15), Button (13 pins), Column (U6.3 U7.3 U8.3)
GND_24V: Main (C1.2 DA1.1 XP2.2), Indication (U3.3 U4.3 U5.3), Hardwiring (C81.2 DA12.1), Bus (C23.2 DA3.1), Flow_sensor (C38.2 DA7.1), Button (C42.1 C43.2 DA8.2 U2.3), Column (U6.4 U7.4 U8.4)
AN_MOD: Main (DD1.62), Bus (DD3.5)
BUS_IL: Main (DD1.61), Bus (DD3.6)
CRASH_COL: Main (DD1.57), Column (R35.2)
CRASH_IND: Main (DD1.3), Indication (R30.2)
DIG_MOD: Main (DD1.63), Bus (DA4.3)
DRV_ON: Main (DD1.64), Bus (DD3.3)
EMER_BUT: Main (DD1.51), Bus (R9.1), Button (DD6.4)
EMIS_COL: Main (DD1.56), Column (R34.2)
EMIS_IND: Main (DD1.2), Indication (R29.2)
ETH_CS: Main (DD1.92), Ethernet (DD10.29)
ETH_INT: Main (DD1.95), Ethernet (DD10.47)
ETH_MISO: Main (DD1.90), Ethernet (DD10.33)
ETH_MOSI: Main (DD1.91), Ethernet (DD10.32)
ETH_RST: Main (DD1.93), Ethernet (DD10.48 R50.1)
ETH_SCLK: Main (DD1.89), Ethernet (DD10.30)
EXT_AN_MOD: Main (DD1.32), Hardwiring (C79.1 R77.2)
EXT_COM1: Main (DD1.39), Hardwiring (DD13.13)
EXT_COM2: Main (DD1.40), Hardwiring (DD13.12)
EXT_COM3: Main (DD1.41), Hardwiring (DD13.11)
EXT_DIG_MOD: Main (DD1.38), Hardwiring (DD13.14), Bus (DA4.1)
EXT_FLAG1: Main (DD1.46), Hardwiring (R78.2)
EXT_FLAG2: Main (DD1.44), Hardwiring (R79.2)
EXT_FLAG3: Main (DD1.43), Hardwiring (R80.2)
EXT_FLAG4: Main (DD1.42), Hardwiring (R81.2)
EXT_IL1: Main (DD1.33), Hardwiring (R71.2 U9.16)
EXT_IL2: Main (DD1.34), Hardwiring (R73.2 U9.14)
EXT_KEY: Main (DD1.35), Hardwiring (R74.2 U9.12)
EXT_MP_EN: Main (DD1.36), Hardwiring (R75.2 U9.10)
EXT_PMO: Main (DD1.45), Hardwiring (DD14.2)
FIBER_IL: Main (DD1.5), Fiber_interlock (DD9.4)
FLOW1: Main (DD1.23), Flow_sensor (DD5.14)
FLOW2: Main (DD1.24), Flow_sensor (DD5.13)
FLOW3: Main (DD1.25), Flow_sensor (DD5.12)
FLOW4: Main (DD1.26), Flow_sensor (DD5.11)
GUIDE_LAS: Main (DD1.4), Guide_laser (R10.1)
KEY: Main (DD1.52), Button (DD7.4)
PD1: Main (XP1.1), A10 (C91A10.2 DA15A10.2 R92A10.2)
PD1_ADC: Main (DD1.29), A10 (C95A10.1 R98A10.2)
PD1_ERR: Main (DD1.17), A10 (DA16A10.7)
PD2: Main (XP1.3), A12 (C91A12.2 DA15A12.2 R92A12.2)
PD2_ADC: Main (DD1.30), A12 (C95A12.1 R98A12.2)
PD2_ERR: Main (DD1.18), A12 (DA16A12.7)
POWER_COL: Main (DD1.55), Column (R33.2)
POWER_IND: Main (DD1.1), Indication (R28.2)
RE/DE: Main (DD1.70), Bus (DD4.4 DD4.5)
Rx232: Main (DD1.48), Hardwiring (DD12.2)
Rx485: Main (DD1.69), Bus (DD4.3)
SEL_MOD: Main (DD1.65), Bus (DA4.6)
START_BUT: Main (DD1.53), Button (DD8.4)
START_IND: Main (DD1.54), Button (R27.2)
T1: Main (XP1.5), Thermistor (R99.2 R100.1)
T1_ADC: Main (DD1.31), Thermistor (C97.1 R100.2)
Tx232: Main (DD1.47), Hardwiring (DD12.3)
Tx485: Main (DD1.68), Bus (DD4.6)